# Altium project HU_revB.PrjPcb (part 1 of 4)
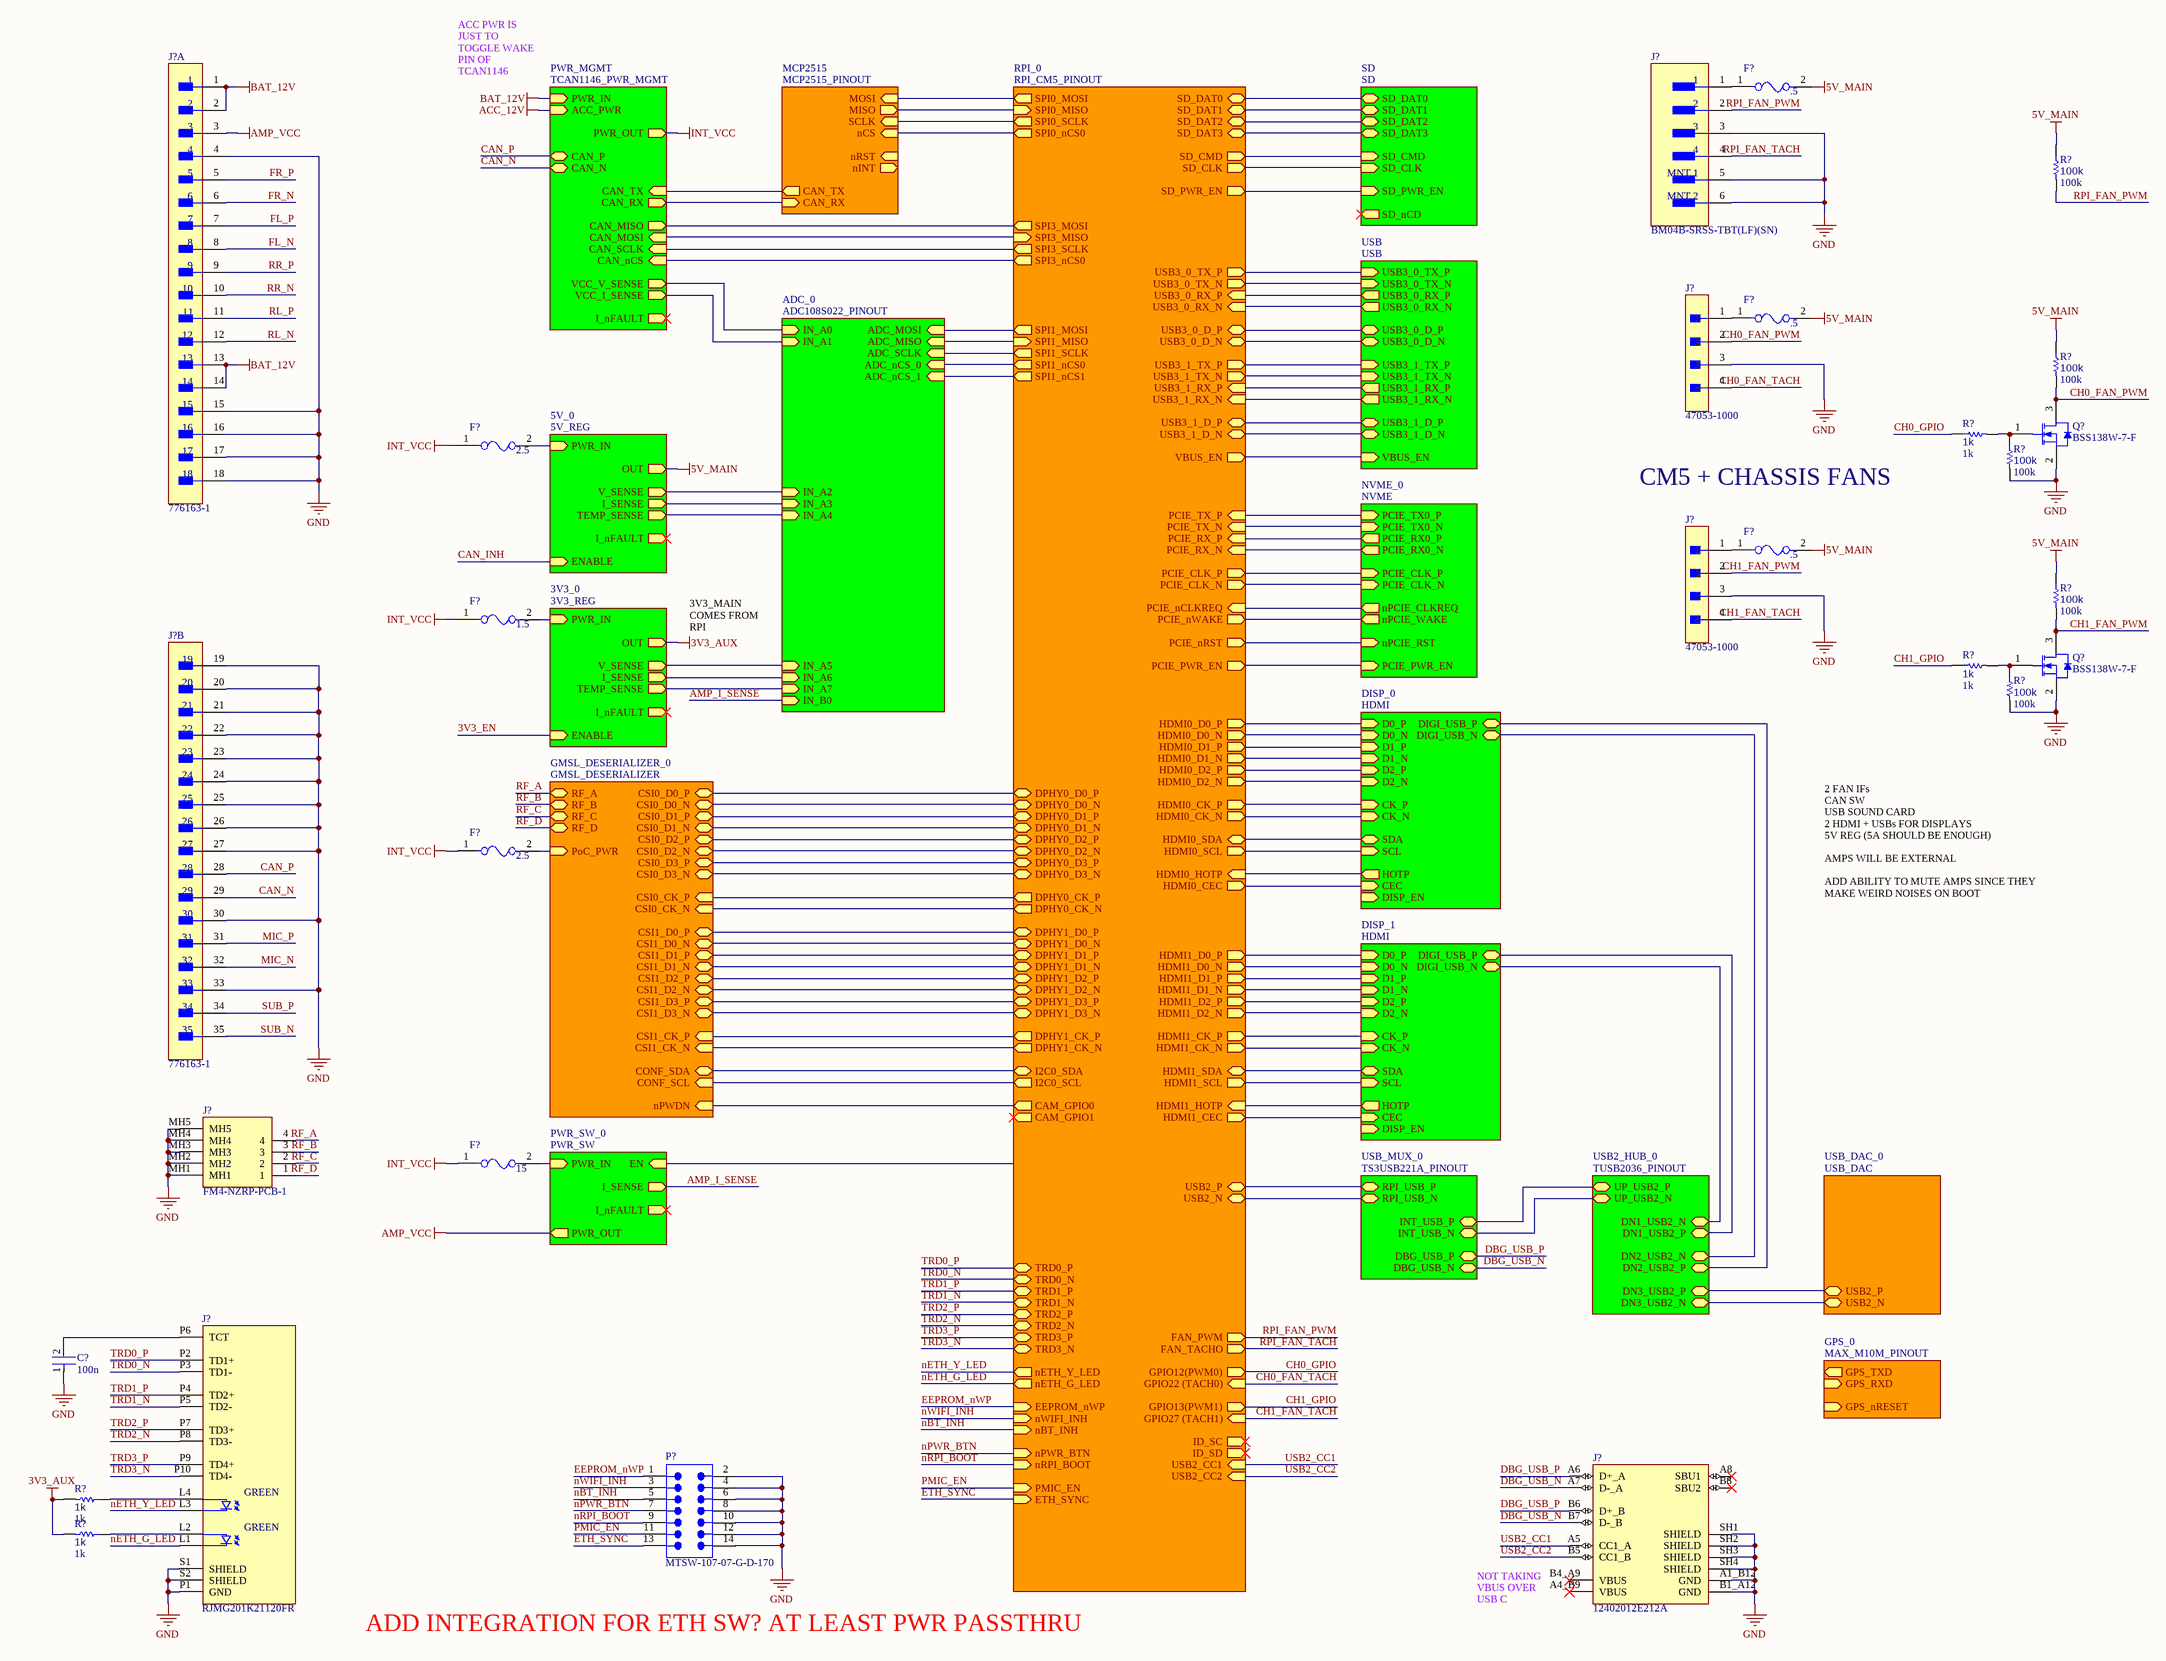
[diagram p0: HU_revB.SchDoc]
17 sheets, 351 parts. Net scope: hierarchical (ports join the sheet entries above them; power ports are global).
Board file: HU_revB.PcbDoc
Sheets:
  HU_revB.SchDoc
    PWR_MGMT = TCAN1146_PWR_MGMT.SchDoc
    USB_DAC_0 = USB_DAC.SchDoc
    RPI_0 = RPI_CM5_PINOUT.SchDoc
    5V_0 = 5V_REG.SchDoc
    NVME_0 = NVME.SchDoc
    MCP2515 = MCP2515_PINOUT.SchDoc
    ADC_0 = ADC108S022_PINOUT.SchDoc
    SD = SD.SchDoc
    USB = USB.SchDoc
    DISP_0 = HDMI.SchDoc
    USB2_HUB_0 = TUSB2036_PINOUT.SchDoc
    DISP_1 = HDMI.SchDoc
    3V3_0 = 3V3_REG.SchDoc
    GMSL_DESERIALIZER_0 = GMSL_DESERIALIZER.SchDoc
    PWR_SW_0 = PWR_SW.SchDoc
    USB_MUX_0 = TS3USB221A_PINOUT.SchDoc
    GPS_0 = MAX_M10M_PINOUT.SchDoc

## Sheet HU_revB.SchDoc
size C; SheetNumber: 1; SheetTotal: 17

### Parts
(Parts that share a designator on the sheet are numbered #1, #2 ... from top to bottom, then left to right.)
C35  100n  [FP-0402-L_1_0_0_05-W_0_5-IPC_A]
F1  .5  [FP-0685T-MFG]
F2  .5  [FP-0685T-MFG]
F3  2.5  [FP-0685T-MFG]
F4  .5  [FP-0685T-MFG]
F5  1.5  [FP-0685T-MFG]
F6  2.5  [FP-0685T-MFG]
F7  15  [FP-0685T-MFG]
J1  776163-1  [FP-776163-1-MFG]  (part B of 2)
J2  BM04B-SRSS-TBT(LF)(SN)  [FP-BM04B-SRSS-TBT_LF_SN-MFG]
J3  47053-1000  [FP-470531000-MFG]
J4  47053-1000  [FP-470531000-MFG]
J5  FM4-NZRP-PCB-1  [FM4-NZRP-PCB-1-Footprint-1]
J6  RJMG201K21120FR  [RJMG201K21120FR-Footprint-1]
J7  12402012E212A  [12402012E212A-Footprint-1]
J?#1  776163-1  [FP-776163-1-MFG]  (part A of 2)
P1  MTSW-107-07-G-D-170  [SMTC-MTSW-107-07-X-D-170]
Q6  BSS138W-7-F  [DIOD-SOT323-3_V]
Q7  BSS138W-7-F  [DIOD-SOT323-3_V]
R16  100k  [R0603B]
R17  100k  [R0603B]
R18  1k  [R0603B]
R19  100k  [R0603B]
R20  100k  [R0603B]
R21  1k  [R0603B]
R22  100k  [R0603B]
R23  1k  [R0603B]
R24  1k  [R0603B]

### Sub-sheets
3V3_0 = 3V3_REG: PWR_IN (in), OUT (out), V_SENSE (out), I_SENSE (out), TEMP_SENSE (out), I_nFAULT (out), ENABLE (in)
5V_0 = 5V_REG: PWR_IN (in), OUT (out), V_SENSE (out), I_SENSE (out), TEMP_SENSE (out), I_nFAULT (out), ENABLE (in)
ADC_0 = ADC108S022_PINOUT: IN_A0 (in), IN_A1 (in), IN_A2 (in), IN_A3 (in), IN_A4 (in), IN_A5 (in), IN_A6 (in), IN_A7 (in), IN_B0 (in), ADC_MOSI (in), ADC_MISO (in), ADC_SCLK (in), ADC_nCS_0 (in), ADC_nCS_1 (in)
DISP_0 = HDMI: D0_N (in), D0_P (in), D2_P (in), D2_N (in), D1_P (in), D1_N (in), CK_P (in), CK_N (in), CEC (in), HOTP (out), SCL (in), SDA (bidir), DISP_EN (in), DIGI_USB_P (bidir), DIGI_USB_N (bidir)
DISP_1 = HDMI: D0_N (in), D0_P (in), D2_P (in), D2_N (in), D1_P (in), D1_N (in), CK_P (in), CK_N (in), CEC (in), HOTP (out), SCL (in), SDA (bidir), DISP_EN (in), DIGI_USB_P (bidir), DIGI_USB_N (bidir)
GMSL_DESERIALIZER_0 = GMSL_DESERIALIZER: CSI0_D0_P (bidir), CSI0_D0_N (bidir), CSI0_D1_P (bidir), CSI0_D1_N (bidir), CSI0_D2_P (bidir), CSI0_D2_N (bidir), CSI0_D3_P (bidir), CSI0_D3_N (bidir), CSI0_CK_P (in), CSI0_CK_N (in), CSI1_D0_P (bidir), CSI1_D0_N (bidir), CSI1_D1_P (bidir), CSI1_D1_N (bidir), CSI1_D2_P (bidir), CSI1_D2_N (bidir), CSI1_D3_P (bidir), CSI1_D3_N (bidir), CSI1_CK_P (in), CSI1_CK_N (in), RF_B (bidir), RF_A (bidir), RF_C (bidir), RF_D (bidir), CONF_SDA (bidir), CONF_SCL (in), nPWDN (in), PoC_PWR (in)
GPS_0 = MAX_M10M_PINOUT: GPS_TXD (out), GPS_RXD (in), GPS_nRESET (in)
MCP2515 = MCP2515_PINOUT: MOSI (in), nCS (in), SCLK (in), MISO (out), nINT (out), nRST (in), CAN_RX (in), CAN_TX (out)
NVME_0 = NVME: nPCIE_RST (in), nPCIE_CLKREQ (out), nPCIE_WAKE (out), PCIE_PWR_EN (in), PCIE_TX0_N (in), PCIE_TX0_P (in), PCIE_RX0_N (out), PCIE_RX0_P (out), PCIE_CLK_N (in), PCIE_CLK_P (in)
PWR_MGMT = TCAN1146_PWR_MGMT: PWR_IN (in), PWR_OUT (out), CAN_P (bidir), CAN_N (bidir), CAN_TX (in), CAN_RX (out), CAN_SCLK (in), CAN_MISO (out), CAN_MOSI (in), CAN_nCS (in), VCC_V_SENSE (out), VCC_I_SENSE (out), I_nFAULT (out), ACC_PWR (in)
PWR_SW_0 = PWR_SW: PWR_IN (in), PWR_OUT (out), EN (in), I_SENSE (out), I_nFAULT (out)
RPI_0 = RPI_CM5_PINOUT: SD_CLK (out), SD_CMD (out), SD_DAT3 (bidir), SD_DAT0 (bidir), SD_DAT1 (bidir), SD_DAT2 (bidir), SD_PWR_EN (out), USB3_0_D_P (bidir), USB3_0_D_N (bidir), USB3_1_D_P (bidir), USB3_1_D_N (bidir), USB3_0_RX_N (in), USB3_0_RX_P (in), USB3_0_TX_N (out), USB3_0_TX_P (out), USB3_1_RX_N (in), USB3_1_RX_P (in), USB3_1_TX_N (out), USB3_1_TX_P (out), VBUS_EN (out), PCIE_nCLKREQ (in), PCIE_nWAKE (out), PCIE_PWR_EN (out), PCIE_CLK_P (out), PCIE_nRST (out), PCIE_CLK_N (out), PCIE_RX_P (in), PCIE_RX_N (in), PCIE_TX_P (in), PCIE_TX_N (in), HDMI1_HOTP (in), HDMI1_SDA (bidir), HDMI1_D2_P (out), HDMI1_D2_N (out), HDMI1_SCL (out), HDMI1_CEC (out), HDMI0_CEC (out), HDMI1_D1_P (out), HDMI1_D1_N (out), HDMI0_HOTP (in), HDMI1_D0_P (out), HDMI1_D0_N (out), HDMI1_CK_P (out), HDMI1_CK_N (out), HDMI0_D2_P (out), HDMI0_D2_N (out), HDMI0_D1_P (out), HDMI0_D1_N (out), HDMI0_D0_P (out), HDMI0_D0_N (out), HDMI0_CK_P (out), HDMI0_CK_N (out), HDMI0_SCL (out), HDMI0_SDA (bidir), USB2_N (bidir), USB2_P (bidir), DPHY0_D0_N (bidir), DPHY0_D0_P (bidir), DPHY0_D1_N (bidir), DPHY0_D1_P (bidir), DPHY0_D2_N (bidir), DPHY0_D2_P (bidir), DPHY0_D3_N (bidir), DPHY0_D3_P (bidir), DPHY0_CK_N (out), DPHY0_CK_P (out), DPHY1_D0_N (bidir), DPHY1_D0_P (bidir), DPHY1_D1_N (bidir), DPHY1_D1_P (bidir), DPHY1_D3_N (bidir), DPHY1_D2_N (bidir), DPHY1_D3_P (bidir), DPHY1_D2_P (bidir), DPHY1_CK_N (out), DPHY1_CK_P (out), TRD3_P (bidir), TRD1_P (bidir), TRD3_N (bidir), TRD1_N (bidir), TRD2_N (bidir), TRD0_N (bidir), TRD2_P (bidir), TRD0_P (bidir), nETH_Y_LED (out), nETH_G_LED (out), FAN_TACHO (out), FAN_PWM (out), SPI0_SCLK (out), SPI0_MISO (in), SPI0_nCS0 (out), SPI0_MOSI (out), SPI3_MOSI (out), SPI3_MISO (in), SPI3_SCLK (out), SPI3_nCS0 (out), SPI1_MISO (in), SPI1_MOSI (out), SPI1_nCS0 (out), SPI1_nCS1 (out), SPI1_SCLK (out), I2C0_SCL (out), I2C0_SDA (bidir), CAM_GPIO0 (out), CAM_GPIO1 (out), ETH_SYNC (in), EEPROM_nWP (in), nWIFI_INH (in), nBT_INH (in), nPWR_BTN (in), nRPI_BOOT (in), PMIC_EN (in), GPIO12(PWM0) (out), GPIO13(PWM1) (out), GPIO22 (TACH0) (in), GPIO27 (TACH1) (in), ID_SC (out), ID_SD (out), USB2_CC1 (in), USB2_CC2 (in)
SD = SD: SD_DAT0 (bidir), SD_DAT1 (bidir), SD_DAT2 (bidir), SD_DAT3 (bidir), SD_CMD (in), SD_CLK (in), SD_PWR_EN (in), SD_nCD (out)
USB = USB: USB3_0_D_P (bidir), USB3_0_D_N (bidir), USB3_1_D_P (bidir), USB3_1_D_N (bidir), VBUS_EN (in), USB3_0_TX_N (in), USB3_0_TX_P (in), USB3_0_RX_N (out), USB3_0_RX_P (out), USB3_1_TX_N (in), USB3_1_TX_P (in), USB3_1_RX_N (out), USB3_1_RX_P (out)
USB2_HUB_0 = TUSB2036_PINOUT: UP_USB2_N (bidir), UP_USB2_P (bidir), DN1_USB2_N (bidir), DN1_USB2_P (bidir), DN2_USB2_N (bidir), DN2_USB2_P (bidir), DN3_USB2_N (bidir), DN3_USB2_P (bidir)
USB_DAC_0 = USB_DAC: USB2_P (bidir), USB2_N (bidir)
USB_MUX_0 = TS3USB221A_PINOUT: RPI_USB_P (bidir), RPI_USB_N (bidir), DBG_USB_P (bidir), DBG_USB_N (bidir), INT_USB_P (bidir), INT_USB_N (bidir)

### Nets
3V3_AUX: R23.2 R24.2 ; sheet 3V3_0/OUT  [project net GPIO_VREF]
5V_MAIN: F1.2 F2.2 F4.2 R16.1 R17.1 R20.1 ; sheet 5V_0/OUT
AMP_VCC: J?#1.3 ; sheet PWR_SW_0/PWR_OUT
BAT_12V: J?#1.1 J?#1.2 J?#1.13 J?#1.14 ; sheet PWR_MGMT/PWR_IN
GND: C35.1 J1.19 J1.20 J1.21 J1.22 J1.23 J1.24 J1.25 J1.26 J1.27 J1.30 J1.33 J2.3 J2.5(MNT_1) J2.6(MNT_2) J3.3 J4.3 J5.MH1 J5.MH2 J5.MH3 J5.MH4 J5.MH5 J6.P1(GND) J6.S1(SHIELD) J6.S2(SHIELD) J7.A1_B12(GND) J7.B1_A12(GND) J7.SH1(SHIELD) J7.SH2(SHIELD) J7.SH3(SHIELD) J7.SH4(SHIELD) J?#1.4 J?#1.15 J?#1.16 J?#1.17 J?#1.18 P1.2 P1.4 P1.6 P1.8 P1.10 P1.12 P1.14 Q6.2(S) Q7.2(S) R19.2 R22.2
INT_VCC: F3.1 F5.1 F6.1 F7.1 ; sheet PWR_MGMT/PWR_OUT  [project net PWR_OUT]
ADC_MISO: sheet RPI_0/SPI1_MISO, sheet ADC_0/ADC_MISO
ADC_MOSI: sheet RPI_0/SPI1_MOSI, sheet ADC_0/ADC_MOSI
ADC_SCLK: sheet RPI_0/SPI1_SCLK, sheet ADC_0/ADC_SCLK
AMP_I_SENSE: sheet ADC_0/IN_B0, sheet PWR_SW_0/I_SENSE
CAM_GPIO0: sheet RPI_0/CAM_GPIO0, sheet GMSL_DESERIALIZER_0/nPWDN
CAN_N: J1.29 ; sheet PWR_MGMT/CAN_N
CAN_P: J1.28 ; sheet PWR_MGMT/CAN_P
CH0_FAN_PWM: J3.2 Q6.3(D) R17.2
CH0_FAN_TACH: J3.4 ; sheet RPI_0/GPIO22 (TACH0)
CH0_GPIO: R18.1 ; sheet RPI_0/GPIO12(PWM0)
CH1_FAN_PWM: J4.2 Q7.3(D) R20.2
CH1_FAN_TACH: J4.4 ; sheet RPI_0/GPIO27 (TACH1)
CH1_GPIO: R21.1 ; sheet RPI_0/GPIO13(PWM1)
CKB_N: sheet RPI_0/DPHY1_CK_N, sheet GMSL_DESERIALIZER_0/CSI1_CK_N
CKB_P: sheet RPI_0/DPHY1_CK_P, sheet GMSL_DESERIALIZER_0/CSI1_CK_P
CKC_N: sheet RPI_0/DPHY0_CK_N, sheet GMSL_DESERIALIZER_0/CSI0_CK_N
CKC_P: sheet RPI_0/DPHY0_CK_P, sheet GMSL_DESERIALIZER_0/CSI0_CK_P
CONF_SCL: sheet RPI_0/I2C0_SCL, sheet GMSL_DESERIALIZER_0/CONF_SCL
CONF_SDA: sheet RPI_0/I2C0_SDA, sheet GMSL_DESERIALIZER_0/CONF_SDA
DA0_N: sheet RPI_0/DPHY0_D0_N, sheet GMSL_DESERIALIZER_0/CSI0_D0_N
DA0_P: sheet RPI_0/DPHY0_D0_P, sheet GMSL_DESERIALIZER_0/CSI0_D0_P
DA1_N: sheet RPI_0/DPHY0_D1_N, sheet GMSL_DESERIALIZER_0/CSI0_D1_N
DA1_P: sheet RPI_0/DPHY0_D1_P, sheet GMSL_DESERIALIZER_0/CSI0_D1_P
DA2_N: sheet RPI_0/DPHY0_D2_N, sheet GMSL_DESERIALIZER_0/CSI0_D2_N
DA2_P: sheet RPI_0/DPHY0_D2_P, sheet GMSL_DESERIALIZER_0/CSI0_D2_P
DA3_N: sheet RPI_0/DPHY0_D3_N, sheet GMSL_DESERIALIZER_0/CSI0_D3_N
DA3_P: sheet RPI_0/DPHY0_D3_P, sheet GMSL_DESERIALIZER_0/CSI0_D3_P
DB0_N: sheet RPI_0/DPHY1_D0_N, sheet GMSL_DESERIALIZER_0/CSI1_D0_N
DB0_P: sheet RPI_0/DPHY1_D0_P, sheet GMSL_DESERIALIZER_0/CSI1_D0_P
DB1_N: sheet RPI_0/DPHY1_D1_N, sheet GMSL_DESERIALIZER_0/CSI1_D1_N
DB1_P: sheet RPI_0/DPHY1_D1_P, sheet GMSL_DESERIALIZER_0/CSI1_D1_P
DB2_N: sheet RPI_0/DPHY1_D2_N, sheet GMSL_DESERIALIZER_0/CSI1_D2_N
DB2_P: sheet RPI_0/DPHY1_D2_P, sheet GMSL_DESERIALIZER_0/CSI1_D2_P
DB3_N: sheet RPI_0/DPHY1_D3_N, sheet GMSL_DESERIALIZER_0/CSI1_D3_N
DB3_P: sheet RPI_0/DPHY1_D3_P, sheet GMSL_DESERIALIZER_0/CSI1_D3_P
DBG_USB_N: J7.A7(D-_A) J7.B7(D-_B) ; sheet USB_MUX_0/DBG_USB_N
DBG_USB_P: J7.A6(D+_A) J7.B6(D+_B) ; sheet USB_MUX_0/DBG_USB_P
DIGI_USB_N: sheet DISP_0/DIGI_USB_N, sheet USB2_HUB_0/DN2_USB2_N
DIGI_USB_N: sheet USB2_HUB_0/DN1_USB2_N, sheet DISP_1/DIGI_USB_N  [a separate net that carries the same name]
DIGI_USB_P: sheet DISP_0/DIGI_USB_P, sheet USB2_HUB_0/DN2_USB2_P
DIGI_USB_P: sheet USB2_HUB_0/DN1_USB2_P, sheet DISP_1/DIGI_USB_P  [a separate net that carries the same name]
EEPROM_nWP: P1.1 ; sheet RPI_0/EEPROM_nWP
ETH_SYNC: P1.13 ; sheet RPI_0/ETH_SYNC
FL_N: J?#1.8
FL_P: J?#1.7
FR_N: J?#1.6
FR_P: J?#1.5
HDMI0_CEC: sheet RPI_0/HDMI0_CEC, sheet DISP_0/CEC
HDMI0_CK_N: sheet RPI_0/HDMI0_CK_N, sheet DISP_0/CK_N
HDMI0_CK_P: sheet RPI_0/HDMI0_CK_P, sheet DISP_0/CK_P
HDMI0_D0_N: sheet RPI_0/HDMI0_D0_N, sheet DISP_0/D0_N
HDMI0_D0_P: sheet RPI_0/HDMI0_D0_P, sheet DISP_0/D0_P
HDMI0_D1_N: sheet RPI_0/HDMI0_D1_N, sheet DISP_0/D1_N
HDMI0_D1_P: sheet RPI_0/HDMI0_D1_P, sheet DISP_0/D1_P
HDMI0_D2_N: sheet RPI_0/HDMI0_D2_N, sheet DISP_0/D2_N
HDMI0_D2_P: sheet RPI_0/HDMI0_D2_P, sheet DISP_0/D2_P
HDMI0_HOTP: sheet RPI_0/HDMI0_HOTP, sheet DISP_0/HOTP
HDMI0_SCL: sheet RPI_0/HDMI0_SCL, sheet DISP_0/SCL
HDMI0_SDA: sheet RPI_0/HDMI0_SDA, sheet DISP_0/SDA
HDMI1_CEC: sheet RPI_0/HDMI1_CEC, sheet DISP_1/CEC
HDMI1_CK_N: sheet RPI_0/HDMI1_CK_N, sheet DISP_1/CK_N
HDMI1_CK_P: sheet RPI_0/HDMI1_CK_P, sheet DISP_1/CK_P
HDMI1_D0_N: sheet RPI_0/HDMI1_D0_N, sheet DISP_1/D0_N
HDMI1_D0_P: sheet RPI_0/HDMI1_D0_P, sheet DISP_1/D0_P
HDMI1_D1_N: sheet RPI_0/HDMI1_D1_N, sheet DISP_1/D1_N
HDMI1_D1_P: sheet RPI_0/HDMI1_D1_P, sheet DISP_1/D1_P
HDMI1_D2_N: sheet RPI_0/HDMI1_D2_N, sheet DISP_1/D2_N
HDMI1_D2_P: sheet RPI_0/HDMI1_D2_P, sheet DISP_1/D2_P
HDMI1_HOTP: sheet RPI_0/HDMI1_HOTP, sheet DISP_1/HOTP
HDMI1_SCL: sheet RPI_0/HDMI1_SCL, sheet DISP_1/SCL
HDMI1_SDA: sheet RPI_0/HDMI1_SDA, sheet DISP_1/SDA
MIC_N: J1.32
MIC_P: J1.31
nBT_INH: P1.5 ; sheet RPI_0/nBT_INH
nETH_G_LED: J6.L1 ; sheet RPI_0/nETH_G_LED
nETH_Y_LED: J6.L3 ; sheet RPI_0/nETH_Y_LED
nPWR_BTN: P1.7 ; sheet RPI_0/nPWR_BTN
nRPI_BOOT: P1.9 ; sheet RPI_0/nRPI_BOOT
nWIFI_INH: P1.3 ; sheet RPI_0/nWIFI_INH
PCIE_CLK_N: sheet RPI_0/PCIE_CLK_N, sheet NVME_0/PCIE_CLK_N
PCIE_CLK_P: sheet RPI_0/PCIE_CLK_P, sheet NVME_0/PCIE_CLK_P
PCIE_nCLKREQ: sheet RPI_0/PCIE_nCLKREQ, sheet NVME_0/nPCIE_CLKREQ
PCIE_nRST: sheet RPI_0/PCIE_nRST, sheet NVME_0/nPCIE_RST
PCIE_nWAKE: sheet RPI_0/PCIE_nWAKE, sheet NVME_0/nPCIE_WAKE
PCIE_PWR_EN: sheet RPI_0/PCIE_PWR_EN, sheet NVME_0/PCIE_PWR_EN
PCIE_RX0_N: sheet RPI_0/PCIE_RX_N, sheet NVME_0/PCIE_RX0_N
PCIE_RX0_P: sheet RPI_0/PCIE_RX_P, sheet NVME_0/PCIE_RX0_P
PCIE_TX0_N: sheet RPI_0/PCIE_TX_N, sheet NVME_0/PCIE_TX0_N
PCIE_TX0_P: sheet RPI_0/PCIE_TX_P, sheet NVME_0/PCIE_TX0_P
PMIC_EN: P1.11 ; sheet RPI_0/PMIC_EN
PoC_PWR: F6.2 ; sheet GMSL_DESERIALIZER_0/PoC_PWR
RF_A: J5.4 ; sheet GMSL_DESERIALIZER_0/RF_A  [project net PoC_A]
RF_B: J5.3 ; sheet GMSL_DESERIALIZER_0/RF_B  [project net PoC_B]
RF_C: J5.2 ; sheet GMSL_DESERIALIZER_0/RF_C  [project net PoC_C]
RF_D: J5.1 ; sheet GMSL_DESERIALIZER_0/RF_D  [project net PoC_D]
RL_N: J?#1.12
RL_P: J?#1.11
RPI_FAN_PWM: J2.2 R16.2 ; sheet RPI_0/FAN_PWM  [project net FAN_PWM]
RPI_FAN_TACH: J2.4 ; sheet RPI_0/FAN_TACHO  [project net FAN_TACHO]
RR_N: J?#1.10
RR_P: J?#1.9
SD_CLK: sheet RPI_0/SD_CLK, sheet SD/SD_CLK
SD_CMD: sheet RPI_0/SD_CMD, sheet SD/SD_CMD
SD_DAT0: sheet RPI_0/SD_DAT0, sheet SD/SD_DAT0
SD_DAT1: sheet RPI_0/SD_DAT1, sheet SD/SD_DAT1
SD_DAT2: sheet RPI_0/SD_DAT2, sheet SD/SD_DAT2
SD_DAT3: sheet RPI_0/SD_DAT3, sheet SD/SD_DAT3
SD_PWR_EN: sheet RPI_0/SD_PWR_EN, sheet SD/SD_PWR_EN
SPI0_MISO: sheet RPI_0/SPI0_MISO, sheet MCP2515/MISO
SPI0_MOSI: sheet RPI_0/SPI0_MOSI, sheet MCP2515/MOSI
SPI0_nCS0: sheet RPI_0/SPI0_nCS0, sheet MCP2515/nCS
SPI0_SCLK: sheet RPI_0/SPI0_SCLK, sheet MCP2515/SCLK
SPI1_nCS0: sheet RPI_0/SPI1_nCS0, sheet ADC_0/ADC_nCS_0
SPI1_nCS1: sheet RPI_0/SPI1_nCS1, sheet ADC_0/ADC_nCS_1
SPI3_MISO: sheet PWR_MGMT/CAN_MOSI, sheet RPI_0/SPI3_MISO
SPI3_MOSI: sheet PWR_MGMT/CAN_MISO, sheet RPI_0/SPI3_MOSI
SPI3_nCS0: sheet PWR_MGMT/CAN_nCS, sheet RPI_0/SPI3_nCS0
SPI3_SCLK: sheet PWR_MGMT/CAN_SCLK, sheet RPI_0/SPI3_SCLK
SUB_N: J1.35
SUB_P: J1.34
TRD0_N: J6.P3(TD1-) ; sheet RPI_0/TRD0_N
TRD0_P: J6.P2(TD1+) ; sheet RPI_0/TRD0_P
TRD1_N: J6.P5(TD2-) ; sheet RPI_0/TRD1_N
TRD1_P: J6.P4(TD2+) ; sheet RPI_0/TRD1_P
TRD2_N: J6.P8(TD3-) ; sheet RPI_0/TRD2_N
TRD2_P: J6.P7(TD3+) ; sheet RPI_0/TRD2_P
TRD3_N: J6.P10(TD4-) ; sheet RPI_0/TRD3_N
TRD3_P: J6.P9(TD4+) ; sheet RPI_0/TRD3_P
USB2_CC1: J7.A5(CC1_A) ; sheet RPI_0/USB2_CC1
USB2_CC2: J7.B5(CC1_B) ; sheet RPI_0/USB2_CC2
USB2_N: sheet RPI_0/USB2_N, sheet USB_MUX_0/RPI_USB_N
USB2_P: sheet RPI_0/USB2_P, sheet USB_MUX_0/RPI_USB_P
USB3_0_D_N: sheet RPI_0/USB3_0_D_N, sheet USB/USB3_0_D_N
USB3_0_D_P: sheet RPI_0/USB3_0_D_P, sheet USB/USB3_0_D_P
USB3_0_RX_N: sheet RPI_0/USB3_0_RX_N, sheet USB/USB3_0_RX_N
USB3_0_RX_P: sheet RPI_0/USB3_0_RX_P, sheet USB/USB3_0_RX_P
USB3_0_TX_N: sheet RPI_0/USB3_0_TX_N, sheet USB/USB3_0_TX_N
USB3_0_TX_P: sheet RPI_0/USB3_0_TX_P, sheet USB/USB3_0_TX_P
USB3_1_D_N: sheet RPI_0/USB3_1_D_N, sheet USB/USB3_1_D_N
USB3_1_D_P: sheet RPI_0/USB3_1_D_P, sheet USB/USB3_1_D_P
USB3_1_RX_N: sheet RPI_0/USB3_1_RX_N, sheet USB/USB3_1_RX_N
USB3_1_RX_P: sheet RPI_0/USB3_1_RX_P, sheet USB/USB3_1_RX_P
USB3_1_TX_N: sheet RPI_0/USB3_1_TX_N, sheet USB/USB3_1_TX_N
USB3_1_TX_P: sheet RPI_0/USB3_1_TX_P, sheet USB/USB3_1_TX_P
VBUS_EN: sheet RPI_0/VBUS_EN, sheet USB/VBUS_EN
NetC35_2: C35.2 J6.P6(TCT)
NetC82_1: sheet USB_DAC_0/USB2_P, sheet USB2_HUB_0/DN3_USB2_P
NetC85_1: sheet USB_DAC_0/USB2_N, sheet USB2_HUB_0/DN3_USB2_N
NetC?#1_1: F3.2 ; sheet 5V_0/PWR_IN
NetC?#12_1: F5.2 ; sheet 3V3_0/PWR_IN
NetD45_1: sheet PWR_MGMT/VCC_V_SENSE, sheet ADC_0/IN_A0
NetF1_1: F1.1 J2.1
NetF2_1: F2.1 J3.1
NetF4_1: F4.1 J4.1
NetF7_2: F7.2 ; sheet PWR_SW_0/PWR_IN
NetJ6_L2: J6.L2 R24.1
NetJ6_L4: J6.L4 R23.1
NetQ6_1: Q6.1(G) R18.2 R19.1
NetQ7_1: Q7.1(G) R21.2 R22.1
NetR40_2: sheet 5V_0/TEMP_SENSE, sheet ADC_0/IN_A4
NetR44_1: sheet 5V_0/I_SENSE, sheet ADC_0/IN_A3
NetR46_1: sheet 5V_0/V_SENSE, sheet ADC_0/IN_A2
NetR63_1: sheet PWR_MGMT/VCC_I_SENSE, sheet ADC_0/IN_A1
NetR78_2: sheet USB2_HUB_0/UP_USB2_N, sheet USB_MUX_0/INT_USB_N
NetR81_2: sheet USB2_HUB_0/UP_USB2_P, sheet USB_MUX_0/INT_USB_P
NetR?#11_2: sheet ADC_0/IN_A7, sheet 3V3_0/TEMP_SENSE
NetR?#15_1: sheet ADC_0/IN_A6, sheet 3V3_0/I_SENSE
NetR?#17_1: sheet ADC_0/IN_A5, sheet 3V3_0/V_SENSE
NetU6_1: sheet PWR_MGMT/CAN_TX, sheet MCP2515/CAN_TX
NetU6_2: sheet PWR_MGMT/CAN_RX, sheet MCP2515/CAN_RX

Not connected (* = marked no-connect by the designer): J7 A4_B9(VBUS)* A8(SBU1)* B4_A9(VBUS)* B8(SBU2)*

### Notes on the sheet
- ACC PWR IS JUST TO TOGGLE WAKE PIN OF TCAN1146
- CM5 + CHASSIS FANS
- 3V3_MAIN COMES FROM RPI
- 2 FAN IFs
  CAN SW
  USB SOUND CARD
  2 HDMI + USBs FOR DISPLAYS
  5V REG (5A SHOULD BE ENOUGH)
  AMPS WILL BE EXTERNAL
  ADD ABILITY TO MUTE AMPS SINCE THEY MAKE WEIRD NOISES ON BOOT
- NOT TAKING VBUS OVER USB C
- ADD INTEGRATION FOR ETH SW? AT LEAST PWR PASSTHRU
- (in symbol CMP-002-00090-1) GREEN

### Library data of the parts
C35 = CMP-001-00058-1: LARGE PADS, 0402 CAP, CHANGE COMMENT TO MATCH REAL P/N; Capacitor Type: Ceramic; Min Operating Temperature: -55°C; Mounting Technology: Surface Mount; Pins: 2; Case/Package: 0402; RoHS Compliant: Yes; Max Operating Temperature: 85°C
F1-F7 = CMP-16042-000006-1: FUSE BOARD MNT 5A 63VAC/VDC 1206; RoHS Compliant: Yes
J1 J?#1 = CMP-03369-000154-1: CONN HEADER R/A 35POS 4MM; Primary Type: Rectangular; Circuit Application: Power; Tab Thickness: 1.3mm; Number of Signal Positions: 35; Shielding: Unshielded; Pitch: 0.157inch; Max Voltage Rating (AC): 250V; Connector System: Wire-to-Device; Insulation: Insulated; Current Rating: 17A; PCB Thickness: 0.062inch; PCB Mount Retention: With; Gender: Male; Connector Type: Male Pin; PCB Mount Alignment: Yes (With); Series: Ampseal; Depth: 37.9mm; Orientation: Right Angle; Length: 3.03inch; Termination: Solder; Radiation Hardening: No; Number of Rows: 3; Contact Plating: Tin; Lead Free: Lead Free; Flammability Rating: UL94 V-0; Contact Material: Brass; Number of Contacts: 35; ELV: Compliant; Max Operating Temperature: 221°C; Min Operating Temperature: -40°C; Package Quantity: 1; Mount: Through Hole; Contact Type: Male Pin; Housing Material: Thermoplastic; Number of Positions: 35; Packaging: Bulk; Row Spacing: 0.157inch; RoHS Compliant: Yes; Height: 32.1mm; Color: Black; Fastening Type: Ramp; Sealable: Yes (With); Width: 37.9mm
J2 = CMP-17439-000370-1: CONN HEADER SMD 4POS 1MM; Voltage Rating: 50V; Number of Positions: 4; Pitch: 0.039inch; Mated Stacking Heights: 4.9mm; Packaging: Cut Tape; Contact Material: Copper Alloy; Lead Free: Lead Free; Contact Type: Male Pin; Fastening Type: Pull; Connector Type: Header; Contact Finish - Mating: TIN; Series: SR; Number of Rows: 1; Contact Shape: Square; Package Quantity: 1; Color: Natural; Flammability Rating: UL94 V-0; Mount: Surface Mount; Insulation Color: Natural; Termination: Solder; Contact Plating: Tin; Insulation Material: Nylon
J3 J4 = CMP-04776-000290-2: CONN HEADER VERT 4POS 2.54MM; NexarPartId: 854935; Manufacturer Lifecycle Status: ACTIVE; Voltage Rating (DC): 250V; Gender: Male; Plating: Copper; Number of Positions: 4; Glow Wire Compliant: Non-compliant; Current Rating: 500mA; Max Operating Temperature: 75°C; Number of Rows: 1; REACH SVHC: Unknown; Ambient Temperature Range High: 105°C; Pitch: 2.54mm; Height: 7.7mm; Min Operating Temperature: 0°C; Packaging: Bulk; Contact Material: Brass, Copper; Contact Plating: Tin; Lead Pitch: 2.54mm; Voltage Rating: 250V; Termination: Through Hole; Radiation Hardening: No; Orientation: Vertical; Mount: Through Hole; Number of Pins: 4; Country of Origin: HK; Halogen Free: Low Halogen; Lifecycle Status: Production; Number of Circuits: 4; Schedule B: 8536694040, 8536694040; Housing Color: Beige; Housing Material: Nylon; Depth: 5.84mm; RoHS: Compliant; Length: 10.2mm; Number of Contacts: 4
J5 = CMP-002-00044-4: Connector RF Mini-FAKRA Plug 9GHz 50Ohm Solder Right Angle Through Hole; Source: fakra4ch.SchLib; Component Type: Standard; Pins: 9; Design Item ID: CMP-002-00085-1
J6 = CMP-002-00090-1: Connector RJ45 Receptacle 8 Position Solder Straight Through Hole 1 Port Tray; Pins: 8; Max Operating Temperature: 70°C; Min Operating Temperature: 0°C
J7 = CMP-002-00091-1: USB Connector, USB Type C, USB 2.0, Receptacle, 24 Ways, Surface Mount, Through Hole Mount; Pins: 24
P1 = CMP-1024-00130-1: Modified .025" SQ Post Header, Through-hole, Vertical, -55 to 125 degC, 2.54 mm Pitch, 14-Pin, Male, RoHS; Manufacturer: Samtec; Pitch: 2.54 mm; ComponentLink3URL: http://www.samtec.com/documents/webfiles/cpdf/MTSW-XXX-XX-X-X-XXXX-XX-XXX-MKT1.pdf; ComponentLink2URL: http://www.samtec.com/documents/webfiles/pdf/MTSW.PDF; PackageVersion: BI, 2/1987; Orientation: Vertical; ComponentLink1URL: http://www.samtec.com; ComponentLink2Description: Datasheet; PackageReference: MTSW-107-07-X-D-170; PartNumber: MTSW-107-07-G-D-170; Temperature Range: -55 to 125 degC; PackageDescription: Assembly .025" [.64] SQ Post Terminal Strip; RoHS: True; ComponentLink3Description: Package Specification; DatasheetVersion: F-214; Mounting Technology: Through-hole; ComponentLink1Description: Manufacturer URL
Q6 Q7 = CMP-2000-05968-1: N-Channel Enhancement Mode Mosfet, 50 V, 200 mA, -55 to 150 degC, 6-Pin SOT-323, RoHS, Tape and Reel; Typical Turn-Off Delay Time: 20ns; Number of Channels: 1Channel; Type: EnhancementModeFieldEffectTransistor; Brand: DiodesIncorporated; Vds - Drain-Source Breakdown Voltage: 75V; Vgs - Gate-Source Voltage: 20V; Rds On - Drain-Source Resistance: 1.4Ohms; Transistor Type: 1N-Channel; Configuration: Single; Unit Weight: 0.000212oz; Pd - Power Dissipation: 200mW; Id - Continuous Drain Current: 200mA; Forward Transconductance - Min: 0.1S; Manufacturer URL: http://www.diodes.com/; Series: BSS138; Package Description: 3-Pin Small Outline Transistor, Body 2 x 1.25 mm, Pitch 0.65 mm; Mounting Technology: SurfaceMount; Product Category: MOSFET; RoHS: True; Maximum Operating Temperature: +150C; Height: 1mm; Length: 2.2mm; Technology: Si; Width: 1.35mm; Datasheet URL: http://www.diodes.com/_files/datasheets/ds30206.pdf; Manufacturer: DiodesIncorporated; Package / Case: SOT-323-3; Typical Turn-On Delay Time: 20ns; Transistor Polarity: N-Channel; Factory Pack Quantity: 3000; Packaging: Reel; Product: MOSFETSmallSignal; Datasheet Version: Rev. 11-2, 09/2013; Package Reference: SOT323; Minimum Operating Temperature: -55C; Mounting Style: SMD/SMT; Channel Mode: Enhancement
R16-R24 = CMP-009-00002-14: Resistor
  R?#1 R?#2 R?#4 R?#5 R?#7: Value: 100k
  R?#3 R?#6 R?#8 R?#9: Value: 1k

## Sheet TCAN1146_PWR_MGMT.SchDoc
size C; SheetNumber: 2; SheetTotal: 17
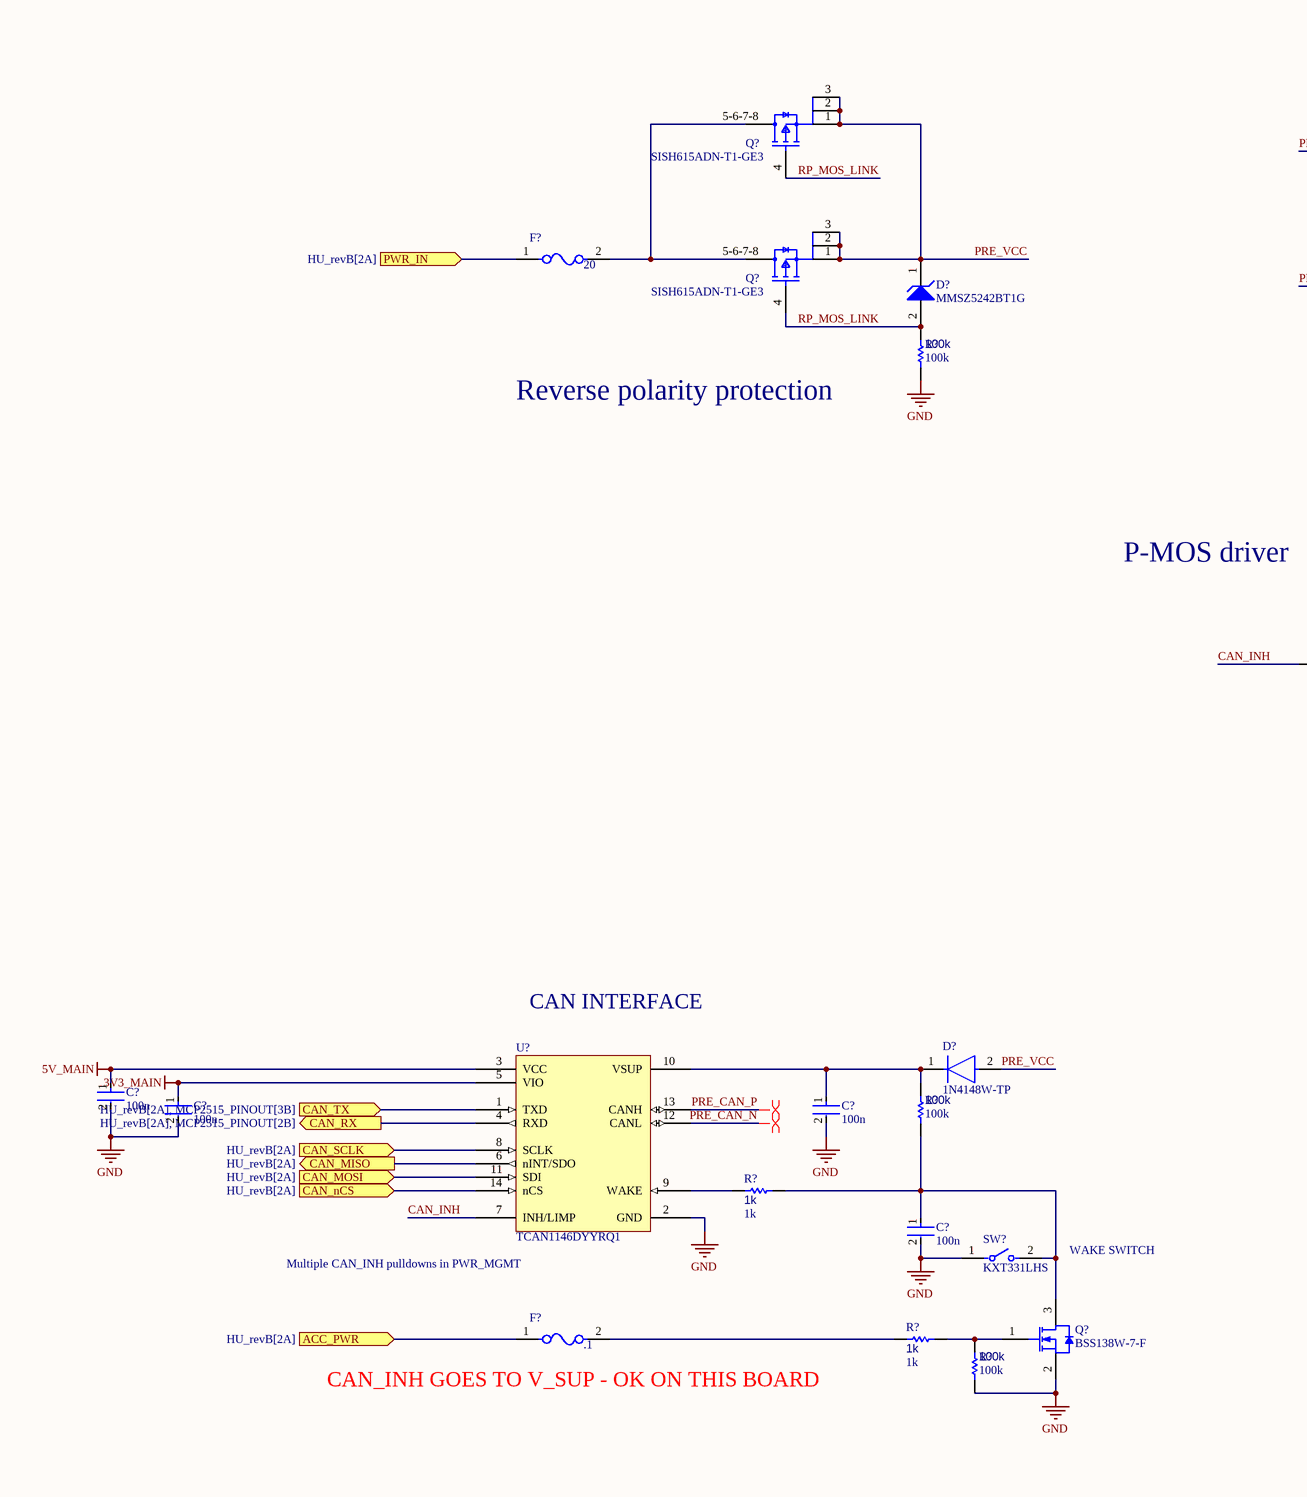
[diagram p1: TCAN1146_PWR_MGMT.SchDoc, left]
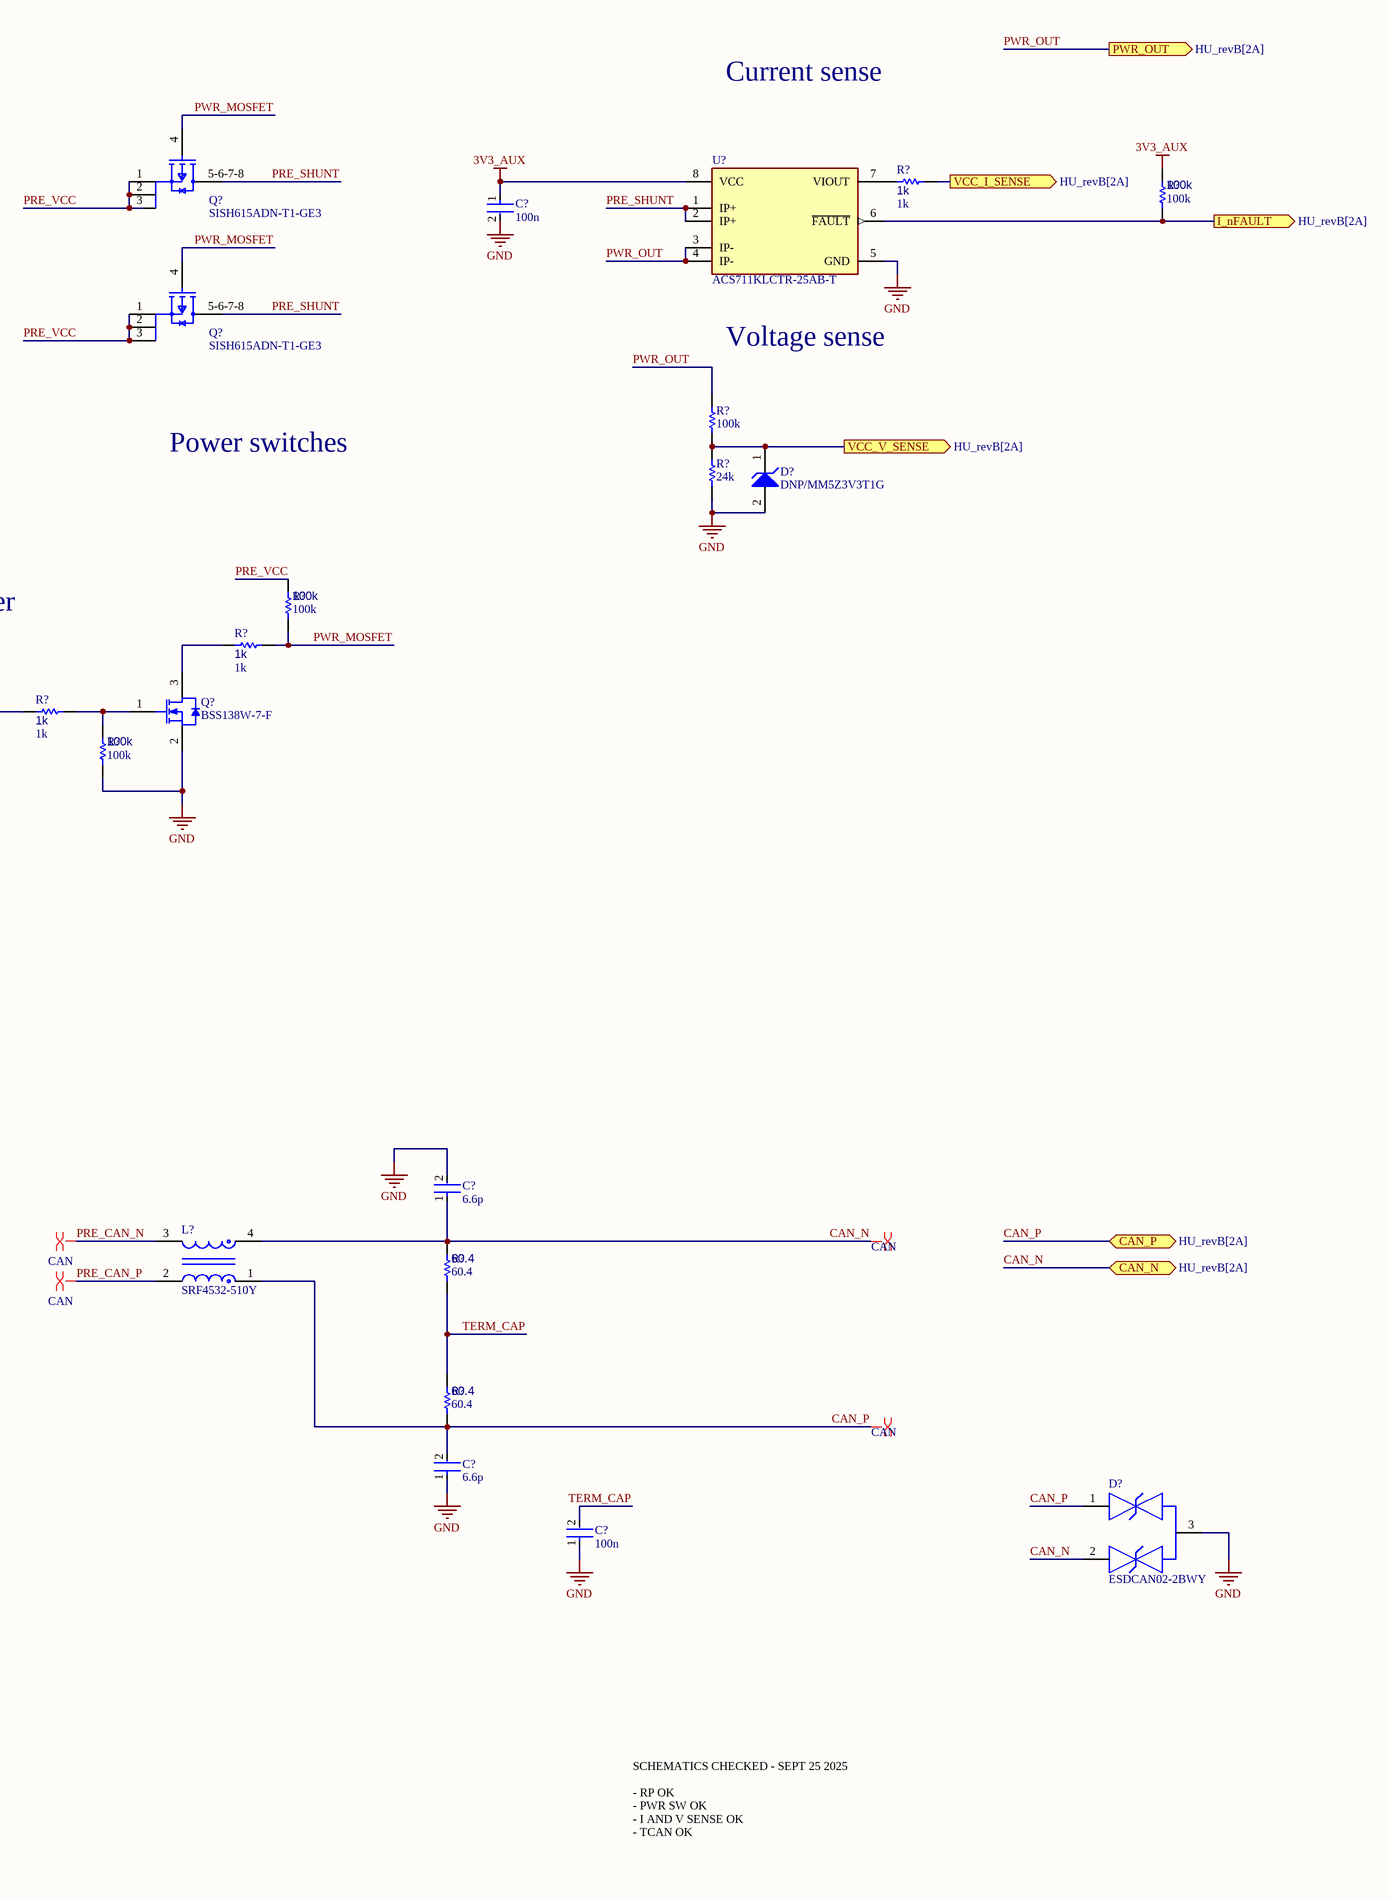
[diagram p2: TCAN1146_PWR_MGMT.SchDoc, right]

### Parts
(Parts that share a designator on the sheet are numbered #1, #2 ... from top to bottom, then left to right.)
C8#1  100n  [FP-0402-L_1_0_0_05-W_0_5-IPC_A]
C9#1  100n  [FP-0402-L_1_0_0_05-W_0_5-IPC_A]
C10#1  100n  [FP-0402-L_1_0_0_05-W_0_5-IPC_A]
C11#1  100n  [FP-0402-L_1_0_0_05-W_0_5-IPC_A]
C12#1  6.6p  [FP-0402-L_1_0_0_05-W_0_5-IPC_A]
C13#1  100n  [FP-0402-L_1_0_0_05-W_0_5-IPC_A]
C14#1  6.6p  [FP-0402-L_1_0_0_05-W_0_5-IPC_A]
C17#1  100n  [FP-0402-L_1_0_0_05-W_0_5-IPC_A]
D1#1  MMSZ5242BT1G  [ONSC-SOD-123-2-425-04_V]
D2#1  1N4148W-TP  [FP-SOD-123-IPC_A]
D3  ESDCAN02-2BWY  [FP-SOT323-3L-MFG]
D45  DNP/MM5Z3V3T1G  [ONSC-SOD-523-2-502-01_V]
F?#1  20  [FP-0685T-MFG]
F?#2  .1  [FP-0685T-MFG]
L1#1  SRF4532-510Y  [FP-SRF4532-MFG]
Q1  SISH615ADN-T1-GE3  [SISH615ADN-T1-GE3-Footprint-1]
Q2  SISH615ADN-T1-GE3  [SISH615ADN-T1-GE3-Footprint-1]
Q3  SISH615ADN-T1-GE3  [SISH615ADN-T1-GE3-Footprint-1]
Q4  SISH615ADN-T1-GE3  [SISH615ADN-T1-GE3-Footprint-1]
Q5  BSS138W-7-F  [DIOD-SOT323-3_V]
Q?#1  BSS138W-7-F  [DIOD-SOT323-3_V]
R25  1k  [R0603B]
R26  100k  [R0603B]
R27  100k  [R0603B]
R29  100k  [R0603B]
R30  1k  [R0603B]
R31  24k  [R0603B]
R32  100k  [R0603B]
R33  100k  [R0603B]
R34  1k  [R0603B]
R35  60.4  [R0603B]
R36  100k  [R0603B]
R37  60.4  [R0603B]
R63  1k  [R0603B]
R69  1k  [R0603B]
R?#1  100k  [R0603B]
SW1  KXT331LHS  [FP-KXT331LHS-MFG]
U7  ACS711KLCTR-25AB-T  [FP-LC-8-IPC_A]
U8  TCAN1146DYYRQ1  [TCAN1146DYYRQ1-Footprint-1]

### Ports
ACC_PWR (in, see HU_revB[2A]), CAN_MISO (out, see HU_revB[2A]), CAN_MOSI (in, see HU_revB[2A]), CAN_N (bidir, see HU_revB[2A]), CAN_nCS (in, see HU_revB[2A]), CAN_P (bidir, see HU_revB[2A]), CAN_RX (out, see HU_revB[2A], MCP2515_PINOUT[2B]), CAN_SCLK (in, see HU_revB[2A]), CAN_TX (in, see HU_revB[2A], MCP2515_PINOUT[3B]), I_nFAULT (out, see HU_revB[2A]), PWR_IN (in, see HU_revB[2A]), PWR_OUT (out, see HU_revB[2A]), VCC_I_SENSE (out, see HU_revB[2A]), VCC_V_SENSE (out, see HU_revB[2A])

### Nets
3V3_AUX: C8#1.1 R26.2 U7.8(VCC)  [project net GPIO_VREF]
3V3_MAIN: C10#1.1 U8.5(VIO)
5V_MAIN: C9#1.1 U8.3(VCC)
ACC_12V: F?#2.1 ; port ACC_PWR
BAT_12V: F?#1.1 ; port PWR_IN
GND: C8#1.2 C9#1.2 C10#1.2 C11#1.2 C12#1.2 C13#1.2 C14#1.1 C17#1.1 D3.3 D45.2(A) Q5.2(S) Q?#1.2(S) R27.1 R31.1 R32.1 R36.1 SW1.1 U7.5(GND) U8.2(GND)
PWR_OUT: R29.2 U7.3(IP-) U7.4(IP-) ; port PWR_OUT
CAN_INH: R30.1 U8.7(INH/LIMP)
CAN_N: C12#1.1 D3.2 L1#1.4 R35.2 ; port CAN_N
CAN_P: C14#1.2 D3.1 L1#1.1 R37.1 ; port CAN_P
PRE_CAN_N: L1#1.3 U8.12(CANL)
PRE_CAN_P: L1#1.2 U8.13(CANH)
PRE_SHUNT: Q2.5-6-7-8(D) Q4.5-6-7-8(D) U7.1(IP+) U7.2(IP+)
PRE_VCC: D1#1.1(K) D2#1.2(A) Q1.1(S) Q1.2(S) Q1.3(S) Q2.1(S) Q2.2(S) Q2.3(S) Q3.1(S) Q3.2(S) Q3.3(S) Q4.1(S) Q4.2(S) Q4.3(S) R?#1.2
PWR_MOSFET: Q2.4(G) Q4.4(G) R69.2 R?#1.1
RP_MOS_LINK: D1#1.2(A) Q1.4(G) Q3.4(G) R27.2
SPI3_MISO: U8.11(SDI) ; port CAN_MOSI
SPI3_MOSI: U8.6(nINT/SDO) ; port CAN_MISO
SPI3_nCS0: U8.14(nCS) ; port CAN_nCS
SPI3_SCLK: U8.8(SCLK) ; port CAN_SCLK
TERM_CAP: C17#1.2 R35.1 R37.2
NetC11#1_1: C11#1.1 D2#1.1(C) R33.2 U8.10(VSUP)
NetC13#1_1: C13#1.1 Q?#1.3(D) R33.1 R34.2 SW1.2
NetD45_1: D45.1(K) R29.1 R31.2 ; port VCC_V_SENSE
NetF?#1_2: F?#1.2 Q1.5-6-7-8(D) Q3.5-6-7-8(D)
NetF?#2_2: F?#2.2 R25.1
NetQ5_1: Q5.1(G) R30.2 R32.2
NetQ5_3: Q5.3(D) R69.1
NetQ?#1_1: Q?#1.1(G) R25.2 R36.2
NetR26_1: R26.1 U7.6(~{FAULT}) ; port I_nFAULT
NetR34_1: R34.1 U8.9(WAKE)
NetR63_1: R63.1 ; port VCC_I_SENSE
NetR63_2: R63.2 U7.7(VIOUT)
NetU6_1: U8.1(TXD) ; port CAN_TX
NetU6_2: U8.4(RXD) ; port CAN_RX

### Layout directives
differential pair: PRE_CAN_N, PRE_CAN_P
differential pair; differential pair class CAN: CAN_N, CAN_P, PRE_CAN_N, PRE_CAN_P

### Notes on the sheet
- Current sense
- Voltage sense
- (near R27) Reverse polarity protection
- Power switches
- P-MOS driver
- CAN INTERFACE
- (near U8) Multiple CAN_INH pulldowns in PWR_MGMT
- WAKE SWITCH
- (near F?#2) CAN_INH GOES TO V_SUP - OK ON THIS BOARD
- SCHEMATICS CHECKED - SEPT 25 2025
  - RP OK
  - PWR SW OK
  - I AND V SENSE OK
  - TCAN OK

### Library data of the parts
C8#1 C9#1 C10#1 C11#1 C12#1 C13#1 C14#1 C17#1 = CMP-001-00058-1: as C35 on sheet HU_revB; Min Operating Temperature: -55°C; Mounting Technology: Surface Mount; Pins: 2; Case/Package: 0402; RoHS Compliant: Yes; Max Operating Temperature: 85°C
D1#1 = CMP-1060-00565-1: Zener Voltage Regulator, 500 mW, 2-Pin SOD-123, Pb-Free, Tape and Reel; Manufacturer: On Semiconductor; P Max (W): 0.5; VZ Typ (V): 12; PartNumber: MMSZ5242BT1G; PackageReference: SOD-123-2-425-04; ComponentLink3URL: http://www.onsemi.com/pub_link/Collateral/425-04.PDF; Mounting Technology: Surface Mount; ComponentLink2Description: Datasheet; ComponentLink1URL: http://www.onsemi.com/; ComponentLink3Description: Package Specification; PackageDescription: 2-Pin SOD, Body 1.6 x 2.69 mm; PackageVersion: Rev. G, 10/2009; ComponentLink1Description: Manufacturer URL; RoHS: Pb-Free; ComponentLink2URL: http://www.onsemi.com/pub_link/Collateral/MMSZ5221BT1-D.PDF; Packing: Tape and Reel; DatasheetVersion: Rev. 12
D2#1 = CMP-2000-04993-2: DIODE GEN PURP 100V 150MA SOD123; Max Reverse Leakage Current: 5uA; Max Surge Current: 2A; Reverse Recovery Time: 4ns; Polarity: Standard; Capacitance: 4pF; Max Forward Surge Current (Ifsm): 1A; Element Configuration: Single; Power Dissipation: 400mW; Forward Voltage: 1V; RoHS: Pb-Free; ComponentLink2Description: Datasheet; PackageReference: SOD-523-2-502-01; DatasheetVersion: Rev. 10; ComponentLink1Description: Manufacturer URL; PackageVersion: Rev. E, 09/2010; ComponentLink3URL: http://www.onsemi.com/pub_link/Collateral/502-01.PDF; ComponentLink2URL: http://www.onsemi.cn/pub_link/Collateral/MM5Z2V4T1-D.PDF; Mounting Technology: Surface Mount; PartNumber: MM5Z3V3T1G; Packing: Tape and Reel; PackageDescription: 2-Pin SOD, Body 1.2 x 0.8 mm; ComponentLink1URL: http://www.onsemi.com/; ComponentLink3Description: Package Specification
D3 = CMP-12225-000055-1: TVS DIODE 26.5V 44V SOT323-3; Manufacturer: STMicroelectronics; Value: 3pF; Direction: Bidirectional; Breakdown Voltage: 28.5V; Automotive Grade: Grade 0; Standoff Height: 0mm; Peak Pulse Power: 170W; Peak Pulse Current: 3A; Number Of Channels: 2; Max Junction Temp: +175°C; Radiation Hardening: No; Lead Free: Lead Free; Max Reverse Voltage (DC): 100V; Current Rating: 150mA; Forward Current: 150mA; Packaging: Tape and Reel; Number of Pins: 2; Package Quantity: 3000; Max Operating Temperature: 150°C; Min Operating Temperature: -65°C; Average Rectified Current: 150mA; Recovery Time: 4ns; Output Current: 150mA; Peak Non-Repetitive Surge Current: 2A; Width: 1.8mm; Voltage Rating (DC): 100V; Height: 1.2mm; Max Repetitive Reverse Voltage (Vrrm): 100V; Mount: Surface Mount; Length: 2.85mm
D45 = CMP-1060-00750-1: Zener Voltage Regulator, 500 mW, 2-Pin SOD-523, Pb-Free, Tape and Reel; Manufacturer: On Semiconductor; P Max (W): 0.5; VZ Typ (V): 3.3; Mouser Description: TVS Diodes / ESD Suppressors Automotive dual-line Transil, Transient voltage suppressor (TVS) for CAN bus; Height: 1.1mm; Category: Diode; Reverse Standoff Voltage: 26.5V; Device Class L1: Circuit Protection; Temperature: -55°C to +175°C; RoHS: TRUE; ComponentLink2URL: https://www.st.com/resource/en/datasheet/esdcan02-2bwy.pdf; Device Class L3: unset; Device Class L2: TVS Diodes; Temperature Range High: +175°C; Octopart: https://octopart.com/esdcan02-2bwy-stmicroelectronics-58631133; Ipc Land Pattern Name: SOT65P210X95-3; Temperature Range Low: -55°C; Capacitance: 3pF; Digikey Description: TVS DIODE 26.5V 44V SOT323-3; Automotive: Yes; ComponentLink2Description: Datasheet; Clamping Voltage: 44V; Manufacturer Part Number: ESDCAN02-2BWY; Lead Free: Yes; Package: SOT323-3L
F?#1 F?#2 = CMP-16042-000006-1: FUSE BOARD MNT 5A 63VAC/VDC 1206; RoHS Compliant: Yes
L1#1 = CMP-07251-000006-1: CMC 51UH 200MA 2LN 2KOHM SMD; Element Configuration: Dual; Number of Lines: 2; Core Material: Ferrite; Impedance: 2kR; Test Frequency: 100kHz; Voltage Rating (DC): 50V; Insulation Resistance: 10MR; Material: Steel; Tolerance: 50%; DC Resistance (DCR): 3.5R; RoHS Compliant: Yes; Mount: Surface Mount; REACH SVHC: No SVHC; Termination: SMD/SMT; DC Current: 200mA; Current: 200mA; Lead Free: Lead Free; Contact Plating: Tin; Length: 4.5mm; Max DC Current: 200mA; Width: 0.126inch; Case/Package: 4532; Packaging: Tape and Reel; Package Quantity: 1; Min Operating Temperature: -40°C; Depth: 3.4mm; Series: SRF4532; Max Operating Temperature: 125°C; Current Rating: 200mA; Self Resonant Frequency: 100kHz; Height: 0.118inch; Inductance: 51uH; Resistance: 2kR
Q1-Q4 = CMP-013-00018-2: Trans MOSFET P-CH 20V 22.1A 8-Pin PowerPAK 1212 EP T/R; Source: SISH615ADN-T1-GE3.SchLib; Design Item ID: CMP-013-00036-4; Component Type: Standard; Pins: 5
Q5 Q?#1 = CMP-2000-05968-1: as Q6 on sheet HU_revB; Manufacturer URL: http://www.diodes.com/; Series: BSS138; Package Description: 3-Pin Small Outline Transistor, Body 2 x 1.25 mm, Pitch 0.65 mm; Mounting Technology: SurfaceMount; Product Category: MOSFET; RoHS: True; Maximum Operating Temperature: +150C; Height: 1mm; Length: 2.2mm; Technology: Si; Width: 1.35mm; Datasheet URL: http://www.diodes.com/_files/datasheets/ds30206.pdf; Manufacturer: DiodesIncorporated; Package / Case: SOT-323-3; Typical Turn-On Delay Time: 20ns; Transistor Polarity: N-Channel; Factory Pack Quantity: 3000; Packaging: Reel; Product: MOSFETSmallSignal; Datasheet Version: Rev. 11-2, 09/2013; Package Reference: SOT323; Minimum Operating Temperature: -55C; Mounting Style: SMD/SMT; Channel Mode: Enhancement
R25-R27 R29-R37 R63 R69 R?#1 = CMP-009-00002-14: Resistor
  R?#10 R?#16 R?#17 R?#20 R?#22: Value: 1k
  R?#11-R?#13 R?#15 R?#18 R?#19 R?#23: Value: 100k
  R?#14: Value: 24k
  R?#21 R?#24: Value: 60.4
SW1 = CMP-10040-000029-1: SWITCH TACTILE SPST-NO 0.02A 15V; Operating Force: 240gf; Switch Travel: 0.13mm; Illumination Type: Non-Illuminated; Throw Configuration: SPST; Number of Ports: 1; Current Rating: 5A; Mechanical Life: 500000Cycles; Switch Function: Off-Mom; Connector Type: USB; Actuator Type: Standard; Gender: Receptacle; Number of Contacts: 24; Contact Plating: Gold; Insulation Color: Black; Min Operating Temperature: -40°C; Packaging: Tape and Reel; Flammability Rating: UL94 V-0; Max Operating Temperature: 85°C; Termination: Solder; Mount: Surface Mount
U7 = CMP-1557-00015-2: SENSOR CURRENT HALL 25A AC/DC; Bandwidth: 100kHz; Min Supply Voltage: 3V; Polarity: Bidirectional; Max Supply Voltage: 5.5V; Max Supply Current: 5.5mA; Number of Channels: 1; Quiescent Current: 4mA; Sensitivity: 55mV/A; Accuracy: 4%; Linearity: 1%; Operating Supply Voltage: 3.3V; Response Time: 4.6us; Case/Package: SOIC; Min Operating Temperature: -40°C; RoHS Compliant: Yes; Length: 4.9mm; Package Quantity: 1; Number of Pins: 8; Width: 3.9mm; REACH SVHC: No SVHC; -3db Bandwidth: 100kHz; Series: -; Packaging: Tape and Reel; Max Operating Temperature: 125°C; Current Sensing: 25A; Height: 1.5mm; Frequency: 100kHz
U8 = CMP-318-000000-2: Automotive CAN FD transceiver with watchdog, bus diagnostics and partial networking via sele 14-SOT-23-THIN -40 to 150; Component Type: Standard; Design Item ID: CMP-015-00012-2; Pin Count: 14; Source: TCAN1146DYYRQ1.SchLib

## Sheet USB_DAC.SchDoc
size A4; SheetNumber: 3; SheetTotal: 3

## Sheet RPI_CM5_PINOUT.SchDoc
size C; SheetNumber: 4; SheetTotal: 17
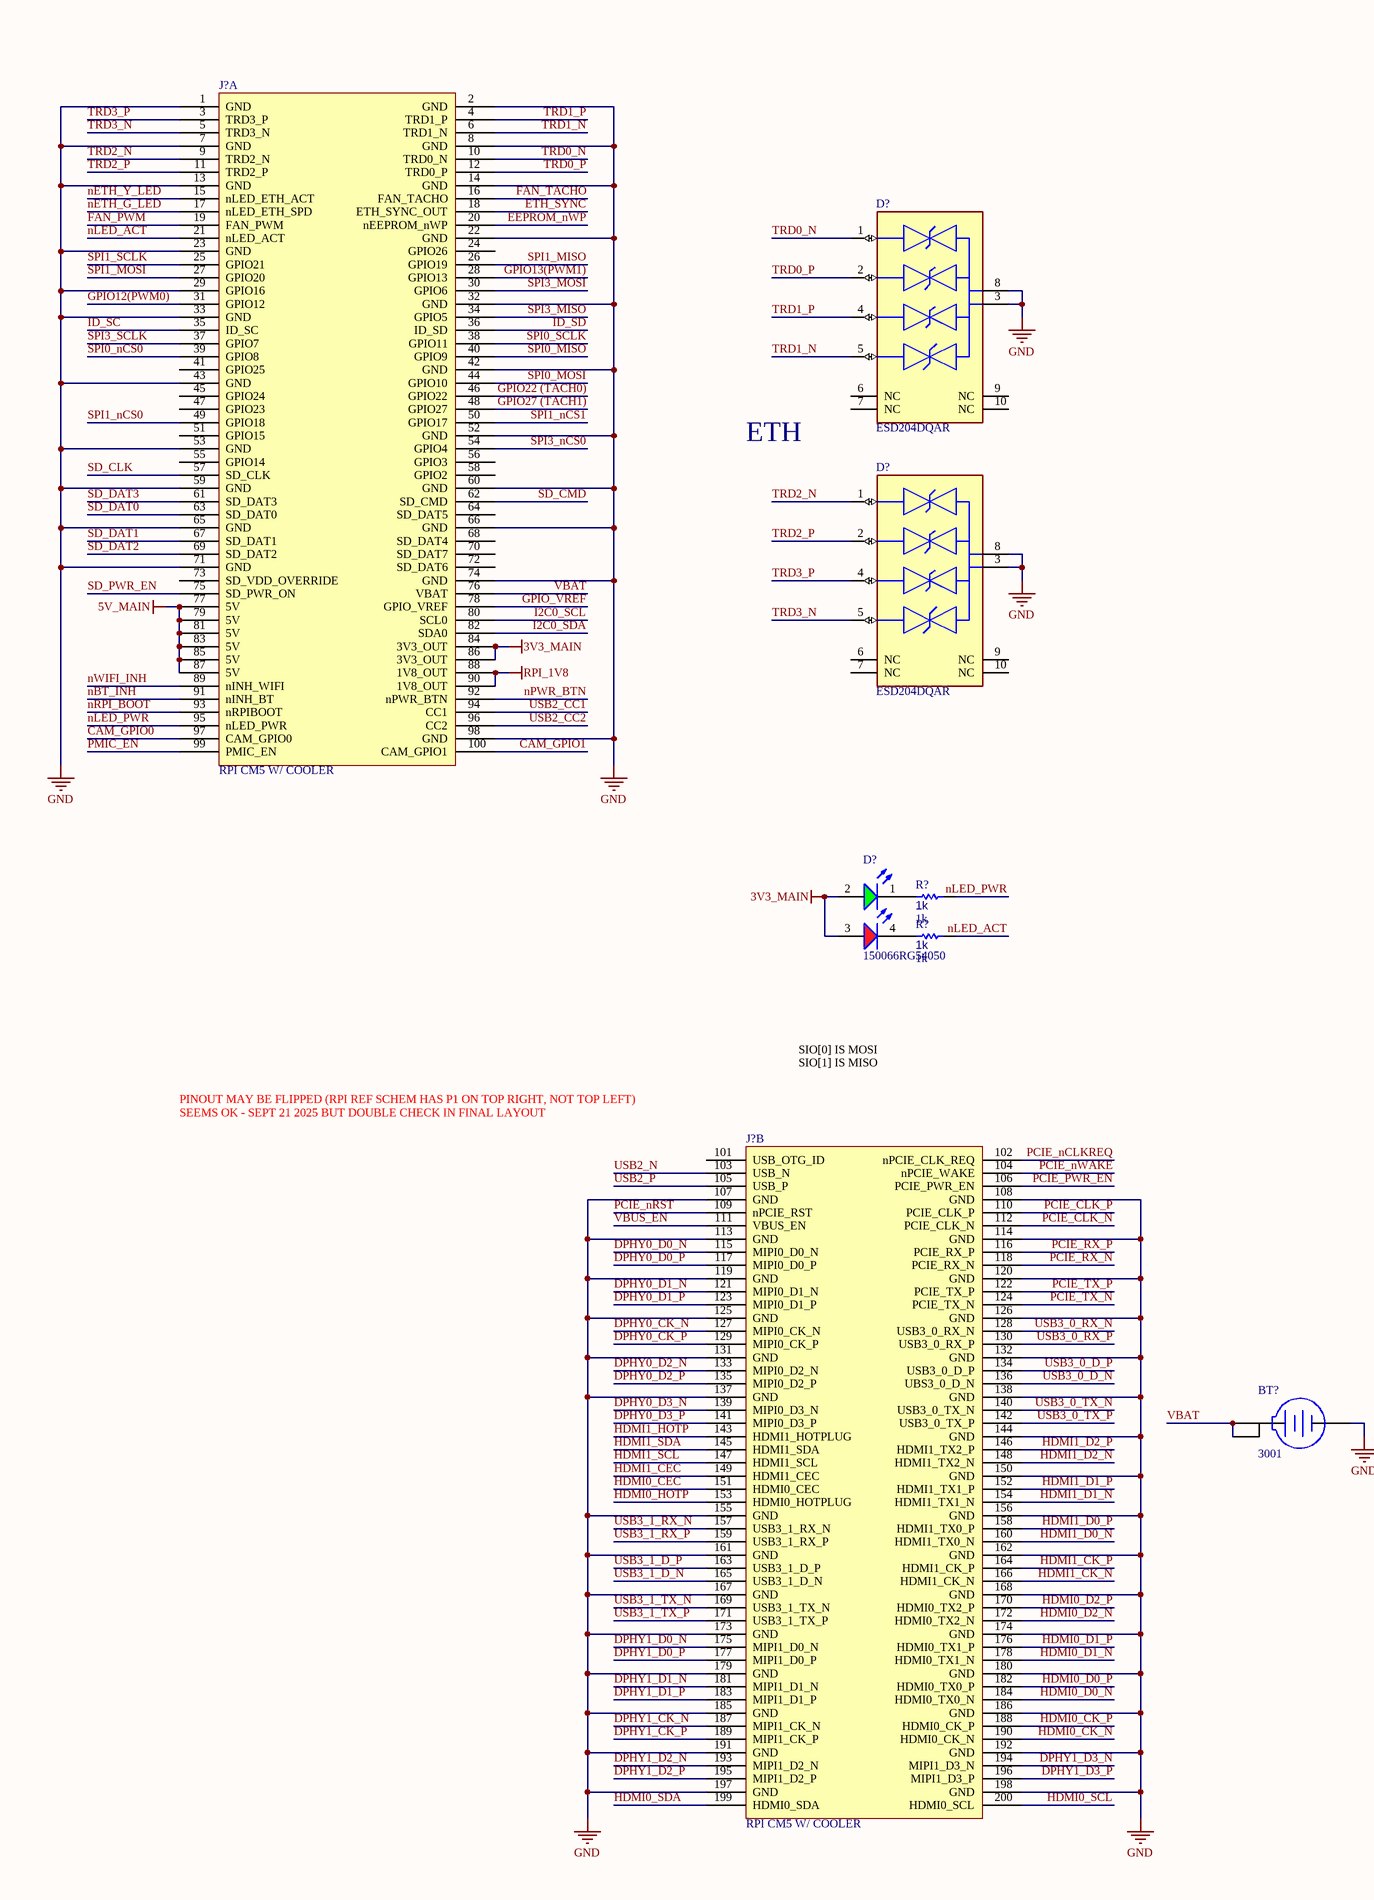
[diagram p3: RPI_CM5_PINOUT.SchDoc, left]
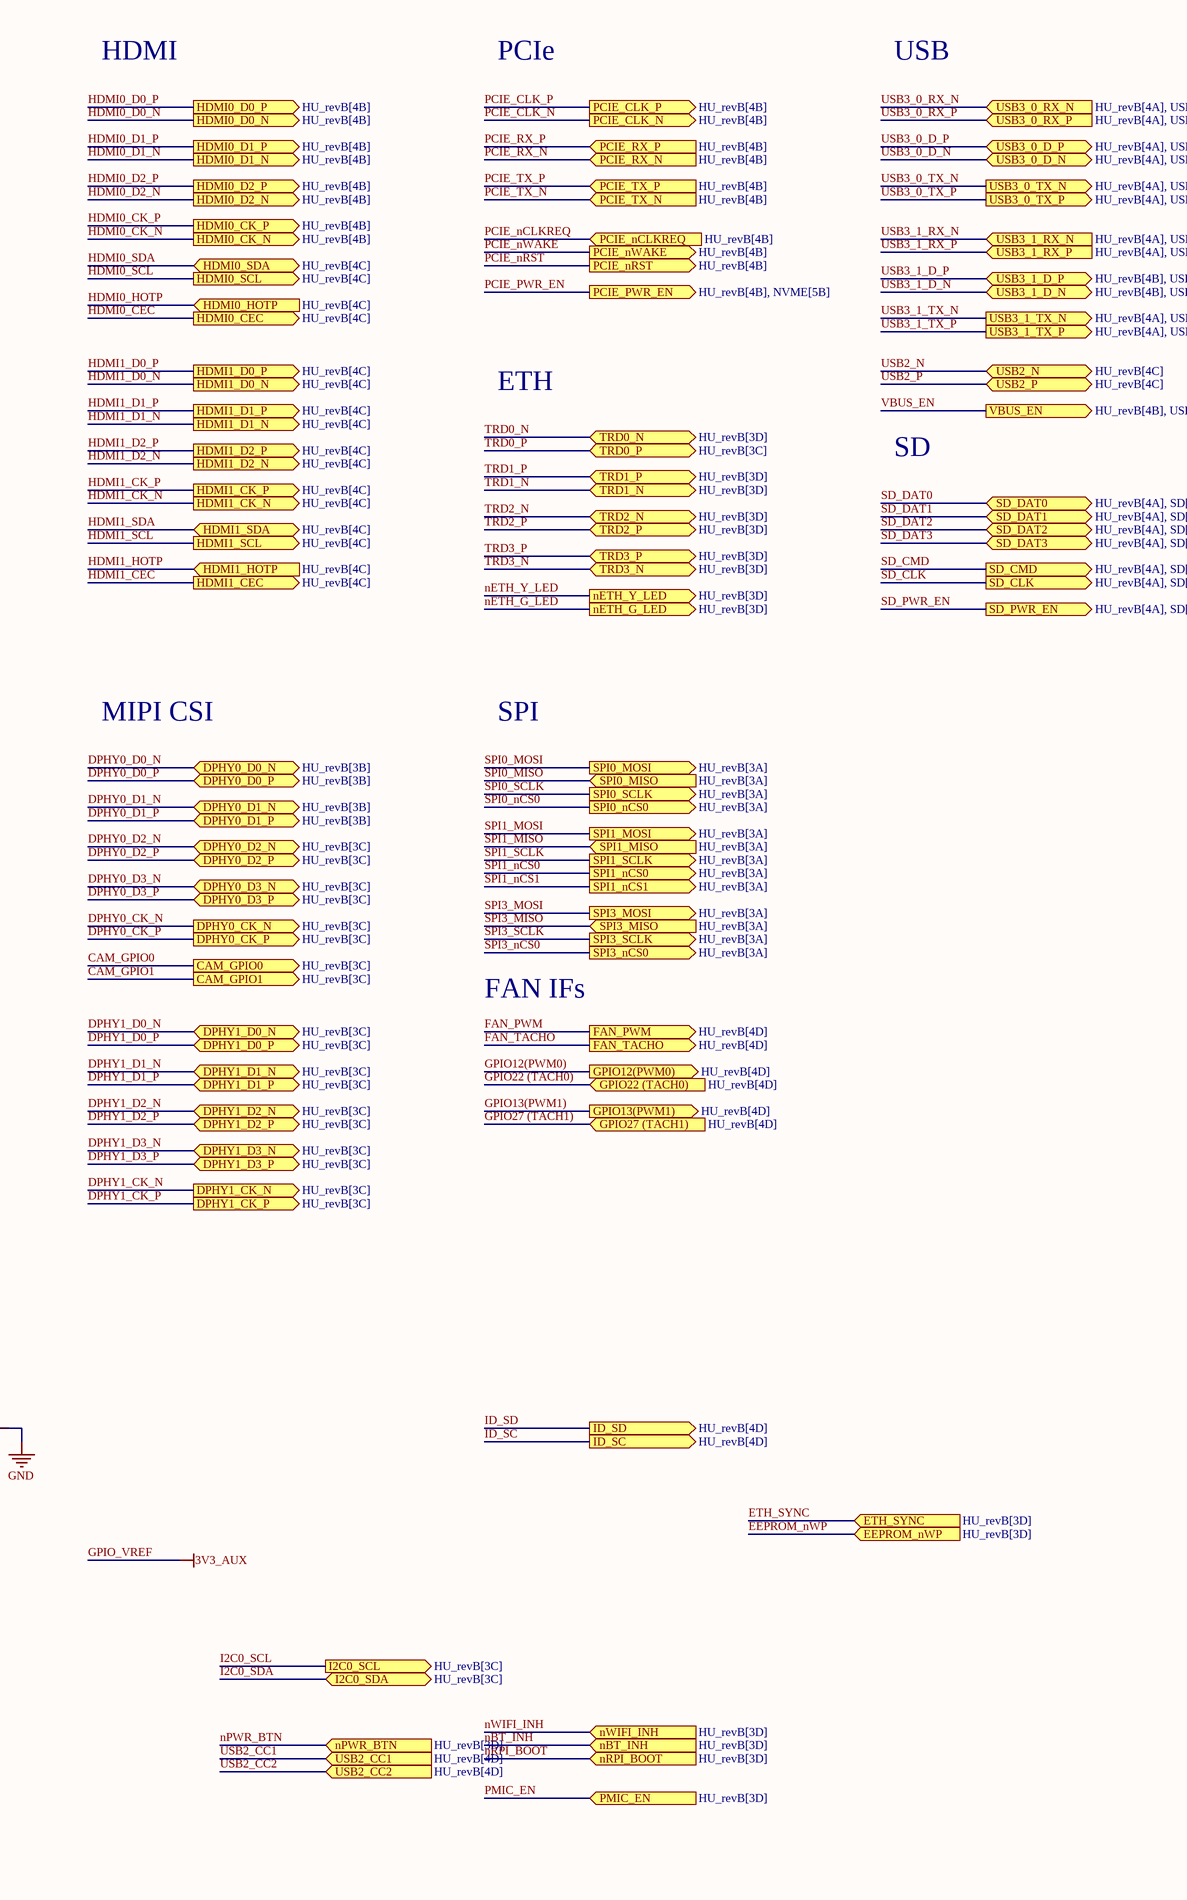
[diagram p4: RPI_CM5_PINOUT.SchDoc, right]

### Parts
(Parts that share a designator on the sheet are numbered #1, #2 ... from top to bottom, then left to right.)
BT1  3001  [KSTN-3001_V]
D4  ESD204DQAR  [FP-DQA0010A-MFG]
D5  ESD204DQAR  [FP-DQA0010A-MFG]
D6  150066RG54050  [WL-SBCD_0606]
J?#2  RPI CM5 W/ COOLER  [RPI CM5 W_ COOLER-Footprint-1]  (part A of 2)
J?#3  RPI CM5 W/ COOLER  [RPI CM5 W_ COOLER-Footprint-1]  (part B of 2)
R38  1k  [R0603B]
R39  1k  [R0603B]

### Ports
CAM_GPIO0 (out, see HU_revB[3C]), CAM_GPIO1 (out, see HU_revB[3C]), DPHY0_CK_N (out, see HU_revB[3C]), DPHY0_CK_P (out, see HU_revB[3C]), DPHY0_D0_N (bidir, see HU_revB[3B]), DPHY0_D0_P (bidir, see HU_revB[3B]), DPHY0_D1_N (bidir, see HU_revB[3B]), DPHY0_D1_P (bidir, see HU_revB[3B]), DPHY0_D2_N (bidir, see HU_revB[3C]), DPHY0_D2_P (bidir, see HU_revB[3C]), DPHY0_D3_N (bidir, see HU_revB[3C]), DPHY0_D3_P (bidir, see HU_revB[3C]), DPHY1_CK_N (out, see HU_revB[3C]), DPHY1_CK_P (out, see HU_revB[3C]), DPHY1_D0_N (bidir, see HU_revB[3C]), DPHY1_D0_P (bidir, see HU_revB[3C]), DPHY1_D1_N (bidir, see HU_revB[3C]), DPHY1_D1_P (bidir, see HU_revB[3C]), DPHY1_D2_N (bidir, see HU_revB[3C]), DPHY1_D2_P (bidir, see HU_revB[3C]), DPHY1_D3_N (bidir, see HU_revB[3C]), DPHY1_D3_P (bidir, see HU_revB[3C]), EEPROM_nWP (in, see HU_revB[3D]), ETH_SYNC (in, see HU_revB[3D]), FAN_PWM (out, see HU_revB[4D]), FAN_TACHO (out, see HU_revB[4D]), GPIO12(PWM0) (out, see HU_revB[4D]), GPIO13(PWM1) (out, see HU_revB[4D]), GPIO22 (TACH0) (in, see HU_revB[4D]), GPIO27 (TACH1) (in, see HU_revB[4D]), HDMI0_CEC (out, see HU_revB[4C]), HDMI0_CK_N (out, see HU_revB[4B]), HDMI0_CK_P (out, see HU_revB[4B]), HDMI0_D0_N (out, see HU_revB[4B]), HDMI0_D0_P (out, see HU_revB[4B]), HDMI0_D1_N (out, see HU_revB[4B]), HDMI0_D1_P (out, see HU_revB[4B]), HDMI0_D2_N (out, see HU_revB[4B]), HDMI0_D2_P (out, see HU_revB[4B]), HDMI0_HOTP (in, see HU_revB[4C]), HDMI0_SCL (out, see HU_revB[4C]), HDMI0_SDA (bidir, see HU_revB[4C]), HDMI1_CEC (out, see HU_revB[4C]), HDMI1_CK_N (out, see HU_revB[4C]), HDMI1_CK_P (out, see HU_revB[4C]), HDMI1_D0_N (out, see HU_revB[4C]), HDMI1_D0_P (out, see HU_revB[4C]), HDMI1_D1_N (out, see HU_revB[4C]), HDMI1_D1_P (out, see HU_revB[4C]), HDMI1_D2_N (out, see HU_revB[4C]), HDMI1_D2_P (out, see HU_revB[4C]), HDMI1_HOTP (in, see HU_revB[4C]), HDMI1_SCL (out, see HU_revB[4C]), HDMI1_SDA (bidir, see HU_revB[4C]), I2C0_SCL (out, see HU_revB[3C]), I2C0_SDA (bidir, see HU_revB[3C]), ID_SC (out, see HU_revB[4D]), ID_SD (out, see HU_revB[4D]), nBT_INH (in, see HU_revB[3D]), nETH_G_LED (out, see HU_revB[3D]), nETH_Y_LED (out, see HU_revB[3D]), nPWR_BTN (in, see HU_revB[3D]), nRPI_BOOT (in, see HU_revB[3D]), nWIFI_INH (in, see HU_revB[3D]), PCIE_CLK_N (out, see HU_revB[4B]), PCIE_CLK_P (out, see HU_revB[4B]), PCIE_nCLKREQ (in, see HU_revB[4B]), PCIE_nRST (out, see HU_revB[4B]), PCIE_nWAKE (out, see HU_revB[4B]), PCIE_PWR_EN (out, see HU_revB[4B], NVME[5B]), PCIE_RX_N (in, see HU_revB[4B]), PCIE_RX_P (in, see HU_revB[4B]), PCIE_TX_N (in, see HU_revB[4B]), PCIE_TX_P (in, see HU_revB[4B]), PMIC_EN (in, see HU_revB[3D]), SD_CLK (out, see HU_revB[4A], SD[3B]), SD_CMD (out, see HU_revB[4A], SD[3B]), SD_DAT0 (bidir, see HU_revB[4A], SD[3B]), SD_DAT1 (bidir, see HU_revB[4A], SD[3B]), SD_DAT2 (bidir, see HU_revB[4A], SD[3B]), SD_DAT3 (bidir, see HU_revB[4A], SD[3B]), SD_PWR_EN (out, see HU_revB[4A], SD[1B]), SPI0_MISO (in, see HU_revB[3A]), SPI0_MOSI (out, see HU_revB[3A]), SPI0_nCS0 (out, see HU_revB[3A]), SPI0_SCLK (out, see HU_revB[3A]), SPI1_MISO (in, see HU_revB[3A]), SPI1_MOSI (out, see HU_revB[3A]), SPI1_nCS0 (out, see HU_revB[3A]), SPI1_nCS1 (out, see HU_revB[3A]), SPI1_SCLK (out, see HU_revB[3A]), SPI3_MISO (in, see HU_revB[3A]), SPI3_MOSI (out, see HU_revB[3A]), SPI3_nCS0 (out, see HU_revB[3A]), SPI3_SCLK (out, see HU_revB[3A]), TRD0_N (bidir, see HU_revB[3D]), TRD0_P (bidir, see HU_revB[3C]), TRD1_N (bidir, see HU_revB[3D]), TRD1_P (bidir, see HU_revB[3D]), TRD2_N (bidir, see HU_revB[3D]), TRD2_P (bidir, see HU_revB[3D]), TRD3_N (bidir, see HU_revB[3D]), TRD3_P (bidir, see HU_revB[3D]), USB2_CC1 (in, see HU_revB[4D]), USB2_CC2 (in, see HU_revB[4D]), USB2_N (bidir, see HU_revB[4C]), USB2_P (bidir, see HU_revB[4C]), USB3_0_D_N (bidir, see HU_revB[4A], USB[3A]), USB3_0_D_P (bidir, see HU_revB[4A], USB[3A]), USB3_0_RX_N (in, see HU_revB[4A], USB[3B]), USB3_0_RX_P (in, see HU_revB[4A], USB[3B]), USB3_0_TX_N (out, see HU_revB[4A], USB[3B]), USB3_0_TX_P (out, see HU_revB[4A], USB[3B]), USB3_1_D_N (bidir, see HU_revB[4B], USB[3B]), USB3_1_D_P (bidir, see HU_revB[4B], USB[3C]), USB3_1_RX_N (in, see HU_revB[4A], USB[3C]), USB3_1_RX_P (in, see HU_revB[4A], USB[3C]), USB3_1_TX_N (out, see HU_revB[4A], USB[3C]), USB3_1_TX_P (out, see HU_revB[4A], USB[3C]), VBUS_EN (out, see HU_revB[4B], USB[1B])

### Nets
3V3_MAIN: D6.2(A) D6.3(A) J?#2.84(3V3_OUT) J?#2.86(3V3_OUT)
5V_MAIN: J?#2.77(5V) J?#2.79(5V) J?#2.81(5V) J?#2.83(5V) J?#2.85(5V) J?#2.87(5V)
GND: BT1.3(-) D4.3(GND) D4.8(GND) D5.3(GND) D5.8(GND) J?#2.1(GND) J?#2.2(GND) J?#2.7(GND) J?#2.8(GND) J?#2.13(GND) J?#2.14(GND) J?#2.22(GND) J?#2.23(GND) J?#2.29(GPIO16) J?#2.32(GND) J?#2.33(GND) J?#2.42(GND) J?#2.43(GND) J?#2.52(GND) J?#2.53(GND) J?#2.59(GND) J?#2.60(GND) J?#2.65(GND) J?#2.66(GND) J?#2.71(GND) J?#2.74(GND) J?#2.98(GND) J?#3.107(GND) J?#3.108(GND) J?#3.113(GND) J?#3.114(GND) J?#3.119(GND) J?#3.120(GND) J?#3.125(GND) J?#3.126(GND) J?#3.131(GND) J?#3.132(GND) J?#3.137(GND) J?#3.138(GND) J?#3.144(GND) J?#3.150(GND) J?#3.155(GND) J?#3.156(GND) J?#3.161(GND) J?#3.162(GND) J?#3.167(GND) J?#3.168(GND) J?#3.173(GND) J?#3.174(GND) J?#3.179(GND) J?#3.180(GND) J?#3.185(GND) J?#3.186(GND) J?#3.191(GND) J?#3.192(GND) J?#3.197(GND) J?#3.198(GND)
GPIO_VREF: J?#2.78(GPIO_VREF)  [also labelled 3V3_AUX]
RPI_1V8: J?#2.88(1V8_OUT) J?#2.90(1V8_OUT)
CAM_GPIO0: J?#2.97(CAM_GPIO0) ; port CAM_GPIO0
CAM_GPIO1: J?#2.100(CAM_GPIO1) ; port CAM_GPIO1
DPHY0_CK_N: J?#3.127(MIPI0_CK_N) ; port DPHY0_CK_N  [project net CKC_N]
DPHY0_CK_P: J?#3.129(MIPI0_CK_P) ; port DPHY0_CK_P  [project net CKC_P]
DPHY0_D0_N: J?#3.115(MIPI0_D0_N) ; port DPHY0_D0_N  [project net DA0_N]
DPHY0_D0_P: J?#3.117(MIPI0_D0_P) ; port DPHY0_D0_P  [project net DA0_P]
DPHY0_D1_N: J?#3.121(MIPI0_D1_N) ; port DPHY0_D1_N  [project net DA1_N]
DPHY0_D1_P: J?#3.123(MIPI0_D1_P) ; port DPHY0_D1_P  [project net DA1_P]
DPHY0_D2_N: J?#3.133(MIPI0_D2_N) ; port DPHY0_D2_N  [project net DA2_N]
DPHY0_D2_P: J?#3.135(MIPI0_D2_P) ; port DPHY0_D2_P  [project net DA2_P]
DPHY0_D3_N: J?#3.139(MIPI0_D3_N) ; port DPHY0_D3_N  [project net DA3_N]
DPHY0_D3_P: J?#3.141(MIPI0_D3_P) ; port DPHY0_D3_P  [project net DA3_P]
DPHY1_CK_N: J?#3.187(MIPI1_CK_N) ; port DPHY1_CK_N  [project net CKB_N]
DPHY1_CK_P: J?#3.189(MIPI1_CK_P) ; port DPHY1_CK_P  [project net CKB_P]
DPHY1_D0_N: J?#3.175(MIPI1_D0_N) ; port DPHY1_D0_N  [project net DB0_N]
DPHY1_D0_P: J?#3.177(MIPI1_D0_P) ; port DPHY1_D0_P  [project net DB0_P]
DPHY1_D1_N: J?#3.181(MIPI1_D1_N) ; port DPHY1_D1_N  [project net DB1_N]
DPHY1_D1_P: J?#3.183(MIPI1_D1_P) ; port DPHY1_D1_P  [project net DB1_P]
DPHY1_D2_N: J?#3.193(MIPI1_D2_N) ; port DPHY1_D2_N  [project net DB2_N]
DPHY1_D2_P: J?#3.195(MIPI1_D2_P) ; port DPHY1_D2_P  [project net DB2_P]
DPHY1_D3_N: J?#3.194(MIPI1_D3_N) ; port DPHY1_D3_N  [project net DB3_N]
DPHY1_D3_P: J?#3.196(MIPI1_D3_P) ; port DPHY1_D3_P  [project net DB3_P]
EEPROM_nWP: J?#2.20(nEEPROM_nWP) ; port EEPROM_nWP
ETH_SYNC: J?#2.18(ETH_SYNC_OUT) ; port ETH_SYNC
FAN_PWM: J?#2.19(FAN_PWM) ; port FAN_PWM
FAN_TACHO: J?#2.16(FAN_TACHO) ; port FAN_TACHO
GPIO12(PWM0): J?#2.31(GPIO12) ; port GPIO12(PWM0)  [project net CH0_GPIO]
GPIO13(PWM1): J?#2.28(GPIO13) ; port GPIO13(PWM1)  [project net CH1_GPIO]
GPIO22 (TACH0): J?#2.46(GPIO22) ; port GPIO22 (TACH0)  [project net CH0_FAN_TACH]
GPIO27 (TACH1): J?#2.48(GPIO27) ; port GPIO27 (TACH1)  [project net CH1_FAN_TACH]
HDMI0_CEC: J?#3.151(HDMI0_CEC) ; port HDMI0_CEC
HDMI0_CK_N: J?#3.190(HDMI0_CK_N) ; port HDMI0_CK_N
HDMI0_CK_P: J?#3.188(HDMI0_CK_P) ; port HDMI0_CK_P
HDMI0_D0_N: J?#3.184(HDMI0_TX0_N) ; port HDMI0_D0_N
HDMI0_D0_P: J?#3.182(HDMI0_TX0_P) ; port HDMI0_D0_P
HDMI0_D1_N: J?#3.178(HDMI0_TX1_N) ; port HDMI0_D1_N
HDMI0_D1_P: J?#3.176(HDMI0_TX1_P) ; port HDMI0_D1_P
HDMI0_D2_N: J?#3.172(HDMI0_TX2_N) ; port HDMI0_D2_N
HDMI0_D2_P: J?#3.170(HDMI0_TX2_P) ; port HDMI0_D2_P
HDMI0_HOTP: J?#3.153(HDMI0_HOTPLUG) ; port HDMI0_HOTP
HDMI0_SCL: J?#3.200(HDMI0_SCL) ; port HDMI0_SCL
HDMI0_SDA: J?#3.199(HDMI0_SDA) ; port HDMI0_SDA
HDMI1_CEC: J?#3.149(HDMI1_CEC) ; port HDMI1_CEC
HDMI1_CK_N: J?#3.166(HDMI1_CK_N) ; port HDMI1_CK_N
HDMI1_CK_P: J?#3.164(HDMI1_CK_P) ; port HDMI1_CK_P
HDMI1_D0_N: J?#3.160(HDMI1_TX0_N) ; port HDMI1_D0_N
HDMI1_D0_P: J?#3.158(HDMI1_TX0_P) ; port HDMI1_D0_P
HDMI1_D1_N: J?#3.154(HDMI1_TX1_N) ; port HDMI1_D1_N
HDMI1_D1_P: J?#3.152(HDMI1_TX1_P) ; port HDMI1_D1_P
HDMI1_D2_N: J?#3.148(HDMI1_TX2_N) ; port HDMI1_D2_N
HDMI1_D2_P: J?#3.146(HDMI1_TX2_P) ; port HDMI1_D2_P
HDMI1_HOTP: J?#3.143(HDMI1_HOTPLUG) ; port HDMI1_HOTP
HDMI1_SCL: J?#3.147(HDMI1_SCL) ; port HDMI1_SCL
HDMI1_SDA: J?#3.145(HDMI1_SDA) ; port HDMI1_SDA
I2C0_SCL: J?#2.80(SCL0) ; port I2C0_SCL  [project net CONF_SCL]
I2C0_SDA: J?#2.82(SDA0) ; port I2C0_SDA  [project net CONF_SDA]
ID_SC: J?#2.35(ID_SC) ; port ID_SC
ID_SD: J?#2.36(ID_SD) ; port ID_SD
nBT_INH: J?#2.91(nINH_BT) ; port nBT_INH
nETH_G_LED: J?#2.17(nLED_ETH_SPD) ; port nETH_G_LED
nETH_Y_LED: J?#2.15(nLED_ETH_ACT) ; port nETH_Y_LED
nLED_ACT: J?#2.21(nLED_ACT) R39.2
nLED_PWR: J?#2.95(nLED_PWR) R38.2
nPWR_BTN: J?#2.92(nPWR_BTN) ; port nPWR_BTN
nRPI_BOOT: J?#2.93(nRPIBOOT) ; port nRPI_BOOT
nWIFI_INH: J?#2.89(nINH_WIFI) ; port nWIFI_INH
PCIE_CLK_N: J?#3.112(PCIE_CLK_N) ; port PCIE_CLK_N
PCIE_CLK_P: J?#3.110(PCIE_CLK_P) ; port PCIE_CLK_P
PCIE_nCLKREQ: J?#3.102(nPCIE_CLK_REQ) ; port PCIE_nCLKREQ
PCIE_nRST: J?#3.109(nPCIE_RST) ; port PCIE_nRST
PCIE_nWAKE: J?#3.104(nPCIE_WAKE) ; port PCIE_nWAKE
PCIE_PWR_EN: J?#3.106(PCIE_PWR_EN) ; port PCIE_PWR_EN
PCIE_RX_N: J?#3.118(PCIE_RX_N) ; port PCIE_RX_N  [project net PCIE_RX0_N]
PCIE_RX_P: J?#3.116(PCIE_RX_P) ; port PCIE_RX_P  [project net PCIE_RX0_P]
PCIE_TX_N: J?#3.124(PCIE_TX_N) ; port PCIE_TX_N  [project net PCIE_TX0_N]
PCIE_TX_P: J?#3.122(PCIE_TX_P) ; port PCIE_TX_P  [project net PCIE_TX0_P]
PMIC_EN: J?#2.99(PMIC_EN) ; port PMIC_EN
SD_CLK: J?#2.57(SD_CLK) ; port SD_CLK
SD_CMD: J?#2.62(SD_CMD) ; port SD_CMD
SD_DAT0: J?#2.63(SD_DAT0) ; port SD_DAT0
SD_DAT1: J?#2.67(SD_DAT1) ; port SD_DAT1
SD_DAT2: J?#2.69(SD_DAT2) ; port SD_DAT2
SD_DAT3: J?#2.61(SD_DAT3) ; port SD_DAT3
SD_PWR_EN: J?#2.75(SD_PWR_ON) ; port SD_PWR_EN
SPI0_MISO: J?#2.40(GPIO9) ; port SPI0_MISO
SPI0_MOSI: J?#2.44(GPIO10) ; port SPI0_MOSI
SPI0_nCS0: J?#2.39(GPIO8) ; port SPI0_nCS0
SPI0_SCLK: J?#2.38(GPIO11) ; port SPI0_SCLK
SPI1_MISO: J?#2.26(GPIO19) ; port SPI1_MISO  [project net ADC_MISO]
SPI1_MOSI: J?#2.27(GPIO20) ; port SPI1_MOSI  [project net ADC_MOSI]
SPI1_nCS0: J?#2.49(GPIO18) ; port SPI1_nCS0
SPI1_nCS1: J?#2.50(GPIO17) ; port SPI1_nCS1
SPI1_SCLK: J?#2.25(GPIO21) ; port SPI1_SCLK  [project net ADC_SCLK]
SPI3_MISO: J?#2.34(GPIO5) ; port SPI3_MISO
SPI3_MOSI: J?#2.30(GPIO6) ; port SPI3_MOSI
SPI3_nCS0: J?#2.54(GPIO4) ; port SPI3_nCS0
SPI3_SCLK: J?#2.37(GPIO7) ; port SPI3_SCLK
TRD0_N: D4.1(IO1) J?#2.10(TRD0_N) ; port TRD0_N
TRD0_P: D4.2(IO2) J?#2.12(TRD0_P) ; port TRD0_P
TRD1_N: D4.5(IO4) J?#2.6(TRD1_N) ; port TRD1_N
TRD1_P: D4.4(IO3) J?#2.4(TRD1_P) ; port TRD1_P
TRD2_N: D5.1(IO1) J?#2.9(TRD2_N) ; port TRD2_N
TRD2_P: D5.2(IO2) J?#2.11(TRD2_P) ; port TRD2_P
TRD3_N: D5.5(IO4) J?#2.5(TRD3_N) ; port TRD3_N
TRD3_P: D5.4(IO3) J?#2.3(TRD3_P) ; port TRD3_P
USB2_CC1: J?#2.94(CC1) ; port USB2_CC1
USB2_CC2: J?#2.96(CC2) ; port USB2_CC2
USB2_N: J?#3.103(USB_N) ; port USB2_N
USB2_P: J?#3.105(USB_P) ; port USB2_P
USB3_0_D_N: J?#3.136(UBS3_0_D_N) ; port USB3_0_D_N
USB3_0_D_P: J?#3.134(USB3_0_D_P) ; port USB3_0_D_P
USB3_0_RX_N: J?#3.128(USB3_0_RX_N) ; port USB3_0_RX_N
USB3_0_RX_P: J?#3.130(USB3_0_RX_P) ; port USB3_0_RX_P
USB3_0_TX_N: J?#3.140(USB3_0_TX_N) ; port USB3_0_TX_N
USB3_0_TX_P: J?#3.142(USB3_0_TX_P) ; port USB3_0_TX_P
USB3_1_D_N: J?#3.165(USB3_1_D_N) ; port USB3_1_D_N
USB3_1_D_P: J?#3.163(USB3_1_D_P) ; port USB3_1_D_P
USB3_1_RX_N: J?#3.157(USB3_1_RX_N) ; port USB3_1_RX_N
USB3_1_RX_P: J?#3.159(USB3_1_RX_P) ; port USB3_1_RX_P
USB3_1_TX_N: J?#3.169(USB3_1_TX_N) ; port USB3_1_TX_N
USB3_1_TX_P: J?#3.171(USB3_1_TX_P) ; port USB3_1_TX_P
VBAT: BT1.1(+) BT1.2(+) J?#2.76(VBAT)
VBUS_EN: J?#3.111(VBUS_EN) ; port VBUS_EN
NetD6_1: D6.1(K) R38.1
NetD6_4: D6.4(K) R39.1

Not connected (* = marked no-connect by the designer): D4 6(NC) 7(NC) 9(NC) 10(NC); D5 6(NC) 7(NC) 9(NC) 10(NC); J?#2 24(GPIO26) 41(GPIO25) 45(GPIO24) 47(GPIO23) 51(GPIO15) 55(GPIO14) 56(GPIO3) 58(GPIO2) 64(SD_DAT5) 68(SD_DAT4) 70(SD_DAT7) 72(SD_DAT6) 73(SD_VDD_OVERRIDE); J?#3 101(USB_OTG_ID)

### Notes on the sheet
- HDMI
- PCIe
- USB
- ETH
- SD
- MIPI CSI
- SPI
- FAN IFs
- PINOUT MAY BE FLIPPED (RPI REF SCHEM HAS P1 ON TOP RIGHT, NOT TOP LEFT)
- SEEMS OK - SEPT 21 2025 BUT DOUBLE CHECK IN FINAL LAYOUT
- SIO[0] IS MOSI
  SIO[1] IS MISO

### Library data of the parts
BT1 = CMP-2000-05463-1: Holder Battery Coin, 12 mm, 2-Pin THD, RoHS; Manufacturer: Keystone; Package Reference: 3001; Package Description: 2-Pin Through Hole Device, Body 13.21 x 12.07 mm; Datasheet Version: Rev. H, 09/2006; Datasheet URL: https://datasheet.ciiva.com/3/3001-3954.pdf; Mounting Technology: ThroughHole; Manufacturer URL: http://www.keyelco.com/
D4 D5 = CMP-04989-000002-1: 4-CHANNEL LOW-CAPACITANCE SURGE; Manufacturer: Texas Instruments; Value: 0.55pF; Reverse Standoff Voltage: 3.6V; Standoff Height: 0mm; Breakdown Voltage: 5.5V; Peak Pulse Current: 5.5A; Clamping Voltage: 11.5V; Direction: Bidirectional; Peak Pulse Power: 50W; Number Of Channels: 4; Ambient Temperature Range High: +125°C; ComponentLink2Description: Datasheet; Height: 0.55mm; Lead Free: Yes; Device Class L3: unset; Temperature Range High: +125°C; Temperature Range Low: -40°C; Package: DQA0010A; Temperature: -40°C to +125°C; Capacitance: 0.55pF; RoHS: TRUE; Mouser Description: 4-Channel Low-Capacitance Surge and ESD Protection Diode 10-USON -40 to 125; Category: Diode; Device Class L1: Circuit Protection; Octopart: https://octopart.com/esd204dqar-texas+instruments-89917476; Device Class L2: TVS Diodes; Ambient Temperature Range Low: -40°C; Manufacturer Part Number: ESD204DQAR; ComponentLink2URL: http://www.ti.com/lit/ds/symlink/esd204.pdf; Automotive: No; Digikey Description: 4-CHANNEL LOW-CAPACITANCE SURGE
D6 = CMP-004-00040-2: Led, Red/Grn, 180Mcd/230Mcd, 624Nm/525Nm Rohs Compliant: Yes; Source: rgled.SchLib; Component Type: Standard; Pins: 4; Design Item ID: CMP-004-00034-2
J?#2 J?#3 = CMP-00028-00005-3: Mechanical placeholder for RPI CM5 w/ active cooler on it
R38 R39 = CMP-009-00002-14: Resistor; Value: 1k